# EAGLE design InkTime (EAGLE 9.7.0)

## Sheet 1 of 2
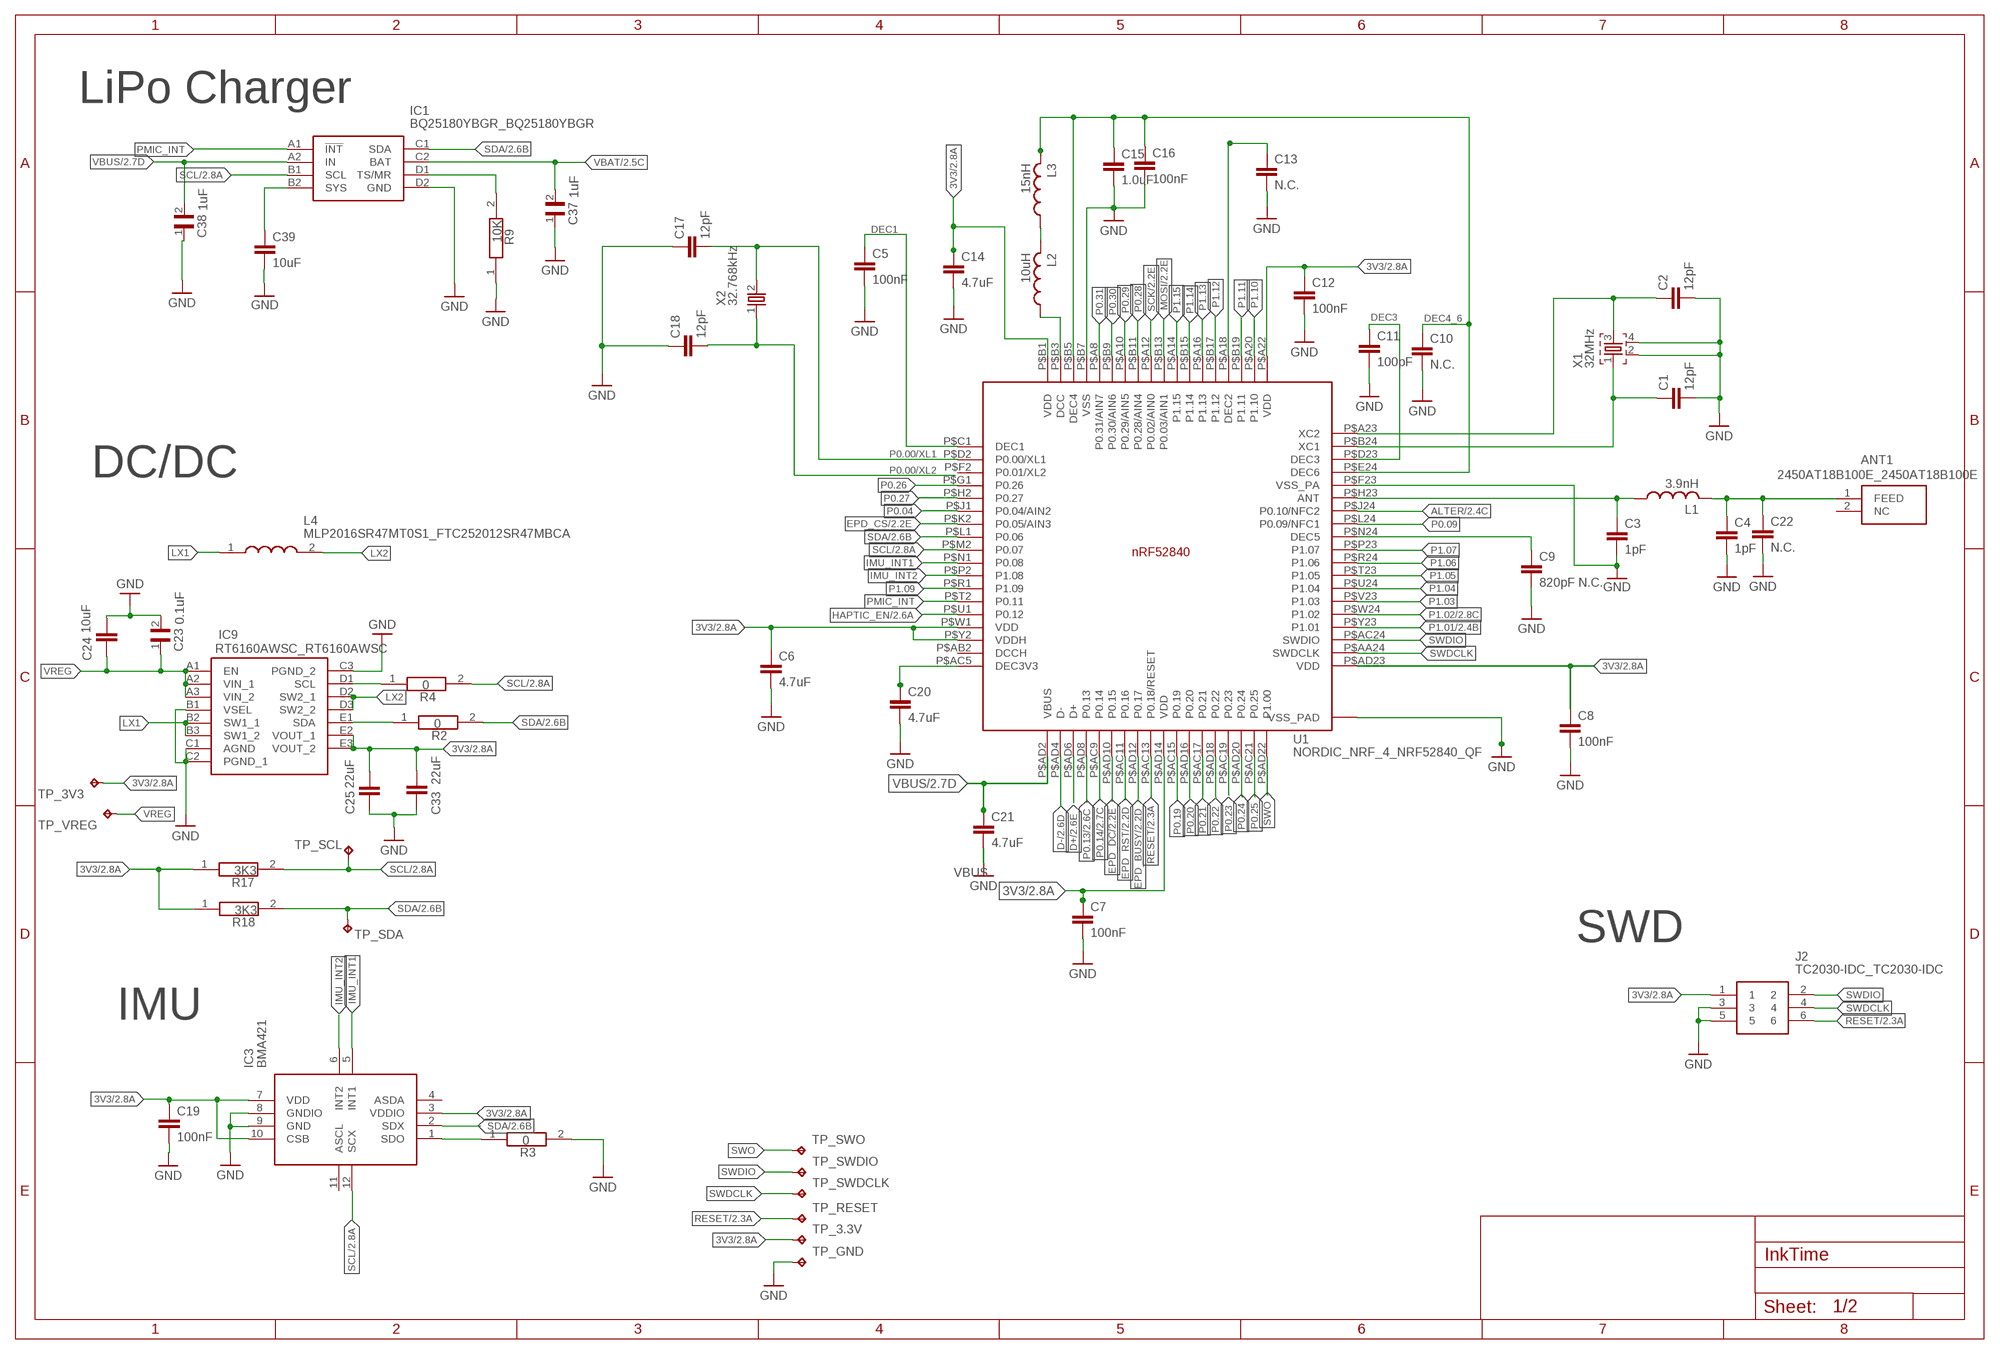
[diagram p0: schematic, sheet 1]

### Parts
ANT1  2450AT18B100E_2450AT18B100E  [2450AT18B100E_ANTC3216X140N]
C1  12pF  NORDIC_NRF_3_CAPACITOR_0201_N  [NORDIC_NRF_3_RESC0201_N]
C2  12pF  NORDIC_NRF_3_CAPACITOR_0201_N  [NORDIC_NRF_3_RESC0201_N]
C3  1pF  NORDIC_NRF_3_CAPACITOR_0201_N  [NORDIC_NRF_3_RESC0201_N]
C4  1pF  NORDIC_NRF_3_CAPACITOR_0201_N  [NORDIC_NRF_3_RESC0201_N]
C5  100nF  NORDIC_NRF_3_CAPACITOR_0201_N  [NORDIC_NRF_3_RESC0201_N]
C6  4.7uF  NORDIC_NRF_3_CAPACITORCAPACITOR_4020  [NORDIC_NRF_3_RESC0402_N]
C7  100nF  NORDIC_NRF_3_CAPACITOR_0201_N  [NORDIC_NRF_3_RESC0201_N]
C8  100nF  NORDIC_NRF_3_CAPACITOR_0201_N  [NORDIC_NRF_3_RESC0201_N]
C9  820pF N.C.  NORDIC_NRF_3_CAPACITOR_0201_N  [NORDIC_NRF_3_RESC0201_N]
C10  N.C.  NORDIC_NRF_3_CAPACITORCAPACITOR_4020  [NORDIC_NRF_3_RESC0402_N]
C11  100pF  NORDIC_NRF_3_CAPACITOR_0201_N  [NORDIC_NRF_3_RESC0201_N]
C12  100nF  NORDIC_NRF_3_CAPACITOR_0201_N  [NORDIC_NRF_3_RESC0201_N]
C13  N.C.  NORDIC_NRF_3_CAPACITOR_0201_N  [NORDIC_NRF_3_RESC0201_N]
C14  4.7uF  NORDIC_NRF_3_CAPACITORCAPACITOR_4020  [NORDIC_NRF_3_RESC0402_N]
C15  1.0uF  NORDIC_NRF_3_CAPACITORCAPACITOR_4020  [NORDIC_NRF_3_RESC0402_N]
C16  100nF  NORDIC_NRF_3_CAPACITOR_0201_N  [NORDIC_NRF_3_RESC0201_N]
C17  12pF  NORDIC_NRF_3_CAPACITOR_0201_N  [NORDIC_NRF_3_RESC0201_N]
C18  12pF  NORDIC_NRF_3_CAPACITOR_0201_N  [NORDIC_NRF_3_RESC0201_N]
C19  100nF  NORDIC_NRF_3_CAPACITOR_0201_N  [NORDIC_NRF_3_RESC0201_N]
C20  4.7uF  NORDIC_NRF_3_CAPACITORCAPACITOR_4020  [NORDIC_NRF_3_RESC0402_N]
C21  4.7uF  NORDIC_NRF_3_CAPACITORCAPACITOR_4020  [NORDIC_NRF_3_RESC0402_N]
C22  N.C.  NORDIC_NRF_3_CAPACITOR_0201_N  [NORDIC_NRF_3_RESC0201_N]
C23  0.1uF  GRM011R60J152KE01L_2_GRM011R60J152KE01LGRM011R60J152KE01L  [GRM011R60J152KE01L_2_CAPC0201X13N]
C24  10uF  NORDIC_NRF_3_CAPACITORCAPACITOR_4020  [NORDIC_NRF_3_RESC0402_N]
C25  22uF  NORDIC_NRF_3_CAPACITORCAPACITOR_4020  [NORDIC_NRF_3_RESC0402_N]
C33  22uF  NORDIC_NRF_3_CAPACITORCAPACITOR_4020  [NORDIC_NRF_3_RESC0402_N]
C37  1uF  GRM011R60J152KE01L_2_GRM011R60J152KE01LGRM011R60J152KE01L  [GRM011R60J152KE01L_2_CAPC0201X13N]
C38  1uF  GRM011R60J152KE01L_2_GRM011R60J152KE01LGRM011R60J152KE01L  [GRM011R60J152KE01L_2_CAPC0201X13N]
C39  10uF  NORDIC_NRF_3_CAPACITORCAPACITOR_4020  [NORDIC_NRF_3_RESC0402_N]
IC1  BQ25180YBGR_BQ25180YBGR  [BQ25180YBGR_BGA8C40P2X4_100X155X50]
IC3  BMA421  BMA423_BMA423  [BMA423_BMA423]
IC9  RT6160AWSC_RT6160AWSC  [RT6160AWSC_BGA15C40P3X5_140X230X60]
J2  TC2030-IDC_TC2030-IDC  [TC2030-IDC_TC2030IDC]
L1  3.9nH  NORDIC_NRF_2_INDUCTOR_0201_N  [NORDIC_NRF_2_RESC0201_N]
L2  10uH  NORDIC_NRF_2_INDUCTOR_0402_N  [NORDIC_NRF_2_RESC0402_N]
L3  15nH  NORDIC_NRF_2_INDUCTOR_0201_N  [NORDIC_NRF_2_RESC0201_N]
L4  MLP2016SR47MT0S1_FTC252012SR47MBCA  [MLP2016SR47MT0S1_INDC2016X100N]
R2  0  CPF0201D7K68C1_CPF0201D7K68C1  [CPF0201D7K68C1_0201]
R3  0  CPF0201D7K68C1_CPF0201D7K68C1  [CPF0201D7K68C1_0201]
R4  0  CPF0201D7K68C1_CPF0201D7K68C1  [CPF0201D7K68C1_0201]
R9  10K  CPF0201D7K68C1_CPF0201D7K68C1  [CPF0201D7K68C1_0201]
R17  3K3  CPF0201D7K68C1_CPF0201D7K68C1  [CPF0201D7K68C1_0201]
R18  3K3  CPF0201D7K68C1_CPF0201D7K68C1  [CPF0201D7K68C1_0201]
TP_3.3V  HECTOR_WATCH_1_TPTP20R  [HECTOR_WATCH_1_TP20R]
TP_3V3  HECTOR_WATCH_1_TPTP20R  [HECTOR_WATCH_1_TP20R]
TP_GND  HECTOR_WATCH_1_TPTP20R  [HECTOR_WATCH_1_TP20R]
TP_RESET  HECTOR_WATCH_1_TPTP20R  [HECTOR_WATCH_1_TP20R]
TP_SCL  HECTOR_WATCH_1_TPTP20R  [HECTOR_WATCH_1_TP20R]
TP_SDA  HECTOR_WATCH_1_TPTP20R  [HECTOR_WATCH_1_TP20R]
TP_SWDCLK  HECTOR_WATCH_1_TPTP20R  [HECTOR_WATCH_1_TP20R]
TP_SWDIO  HECTOR_WATCH_1_TPTP20R  [HECTOR_WATCH_1_TP20R]
TP_SWO  HECTOR_WATCH_1_TPTP20R  [HECTOR_WATCH_1_TP20R]
TP_VREG  HECTOR_WATCH_1_TPTP20R  [HECTOR_WATCH_1_TP20R]
U1  NORDIC_NRF_4_NRF52840_QF  [NORDIC_NRF_4_AQFN50P700X700X85_HS-74N]
X1  32MHz  NORDIC_NRF_XTAL_32MHZ  [NORDIC_NRF_BT-XTAL_2016_N]
X2  32.768kHz  NORDIC_NRF_1_XTAL_32KHZ  [NORDIC_NRF_1_XTAL_3215_N]

### Nets
3V3: C6.1 C7.1 C8.1 C12.1 C14.1 C19.1 C25.1 C33.1 IC3.3(VDDIO) IC3.7(VDD) IC3.10(CSB) IC9.E2(VOUT_1) IC9.E3(VOUT_2) J2.1 R17.1 R18.1 TP_3.3V.TP TP_3V3.TP U1.P$A22(VDD) U1.P$AD14(VDD) U1.P$AD23(VDD) U1.P$B1(VDD) U1.P$W1(VDD) ; also sheet 2
ALTER: U1.P$J24(P0.10/NFC2) ; also sheet 2
D+: U1.P$AD6(D+) ; also sheet 2
D-: U1.P$AD4(D-) ; also sheet 2
DEC1: C5.1 U1.P$C1(DEC1)
DEC2: C13.1 U1.P$A18(DEC2)
DEC3: C11.1 U1.P$D23(DEC3)
DEC4_6: C10.1 C15.1 C16.1 L3.2 U1.P$B5(DEC4) U1.P$E24(DEC6)
EPD_BUSY: U1.P$AD12(P0.17) ; also sheet 2
EPD_CS: U1.P$K2(P0.05/AIN3) ; also sheet 2
EPD_DC: U1.P$AD10(P0.15) ; also sheet 2
EPD_RST: U1.P$AC11(P0.16) ; also sheet 2
GND: C1.2 C2.2 C3.2 C4.2 C5.2 C6.2 C7.2 C8.2 C9.2 C10.2 C11.2 C12.2 C13.2 C14.2 C15.2 C16.2 C17.1 C18.1 C19.2 C20.2 C21.2 C22.2 C23.2 C24.1 C25.2 C33.2 C37.1 C38.1 C39.2 IC1.D2(GND) IC3.8(GNDIO) IC3.9(GND) IC9.B1(VSEL) IC9.C1(AGND) IC9.C2(PGND_1) IC9.C3(PGND_2) J2.3 J2.5 R3.2 R9.1 TP_GND.TP U1.P$74(VSS_PAD) U1.P$75(VSS_PAD) U1.P$76(VSS_PAD) U1.P$77(VSS_PAD) U1.P$78(VSS_PAD) U1.P$79(VSS_PAD) U1.P$80(VSS_PAD) U1.P$81(VSS_PAD) U1.P$82(VSS_PAD) U1.P$83(VSS_PAD) U1.P$84(VSS_PAD) U1.P$85(VSS_PAD) U1.P$86(VSS_PAD) U1.P$87(VSS_PAD) U1.P$88(VSS_PAD) U1.P$89(VSS_PAD) U1.P$90(VSS_PAD) U1.P$B7(VSS) U1.P$F23(VSS_PA) X1.2 X1.4 ; also sheet 2
HAPTIC_EN: U1.P$U1(P0.12) ; also sheet 2
IMU_INT1: IC3.5(INT1) U1.P$N1(P0.08)
IMU_INT2: IC3.6(INT2) U1.P$P2(P1.08)
LX1: IC9.B2(SW1_1) IC9.B3(SW1_2) L4.1
LX2: IC9.D2(SW2_1) IC9.D3(SW2_2) L4.2
MOSI: U1.P$B13(P0.03/AIN1) ; also sheet 2
N$1: L2.2 L3.1
N$2: C20.1 U1.P$AC5(DEC3V3)
N$3: U1.P$Y2(VDDH)
N$4: L2.1 U1.P$B3(DCC)
N$5: C3.1 L1.1 U1.P$H23(ANT)
N$6: C9.1 U1.P$N24(DEC5)
N$7: C2.1 U1.P$A23(XC2) X1.3
N$8: ANT1.1(FEED) C4.1 C22.1 L1.2
N$9: C1.1 U1.P$B24(XC1) X1.1
N$10: IC9.D1(SCL) R4.1
N$11: IC9.E1(SDA) R2.1
N$12: C39.1 IC1.B2(SYS)
N$13: IC1.D1(TS/MR) R9.2
N$14: IC3.1(SDO) R3.1
P0.00/XL1: C17.2 U1.P$D2(P0.00/XL1) X2.2
P0.00/XL2: C18.2 X2.1
P0.04: U1.P$J1(P0.04/AIN2)
P0.09: U1.P$L24(P0.09/NFC1)
P0.13: U1.P$AD8(P0.13) ; also sheet 2
P0.14: U1.P$AC9(P0.14) ; also sheet 2
P0.19: U1.P$AC15(P0.19)
P0.20: U1.P$AD16(P0.20)
P0.21: U1.P$AC17(P0.21)
P0.22: U1.P$AD18(P0.22)
P0.23: U1.P$AC19(P0.23)
P0.24: U1.P$AD20(P0.24)
P0.25: U1.P$AC21(P0.25)
P0.26: U1.P$G1(P0.26)
P0.27: U1.P$H2(P0.27)
P0.28: U1.P$B11(P0.28/AIN4)
P0.29: U1.P$A10(P0.29/AIN5)
P0.30: U1.P$B9(P0.30/AIN6)
P0.31: U1.P$A8(P0.31/AIN7)
P1.01: U1.P$Y23(P1.01) ; also sheet 2
P1.02: U1.P$W24(P1.02) ; also sheet 2
P1.03: U1.P$V23(P1.03)
P1.04: U1.P$U24(P1.04)
P1.05: U1.P$T23(P1.05)
P1.06: U1.P$R24(P1.06)
P1.07: U1.P$P23(P1.07)
P1.09: U1.P$R1(P1.09)
P1.10: U1.P$A20(P1.10)
P1.11: U1.P$B19(P1.11)
P1.12: U1.P$B17(P1.12)
P1.13: U1.P$A16(P1.13)
P1.14: U1.P$B15(P1.14)
P1.15: U1.P$A14(P1.15)
PMIC_INT: IC1.A1(!INT) U1.P$T2(P0.11)
RESET: J2.6 TP_RESET.TP U1.P$AC13(P0.18/RESET) ; also sheet 2
SCK: U1.P$A12(P0.02/AIN0) ; also sheet 2
SCL: IC1.B1(SCL) IC3.12(SCX) R4.2 R17.2 TP_SCL.TP U1.P$M2(P0.07) ; also sheet 2
SDA: IC1.C1(SDA) IC3.2(SDX) R2.2 R18.2 TP_SDA.TP U1.P$L1(P0.06) ; also sheet 2
SWDCLK: J2.4 TP_SWDCLK.TP U1.P$AA24(SWDCLK)
SWDIO: J2.2 TP_SWDIO.TP U1.P$AC24(SWDIO)
SWO: TP_SWO.TP U1.P$AD22(P1.00)
VBAT: C37.2 IC1.C2(BAT) ; also sheet 2
VBUS: C21.1 C38.2 IC1.A2(IN) U1.P$AD2(VBUS) ; also sheet 2
VREG: C23.1 C24.2 IC9.A1(EN) IC9.A2(VIN_1) IC9.A3(VIN_2) TP_VREG.TP
Unconnected: ANT1.2(NC) IC3.4(ASDA) IC3.11(ASCL) U1.P$AB2(DCCH) U1.P$F2(P0.01/XL2)

### Notes on the sheet
- LiPo Charger
- DC/DC
- SWD
- IMU

## Sheet 2 of 2
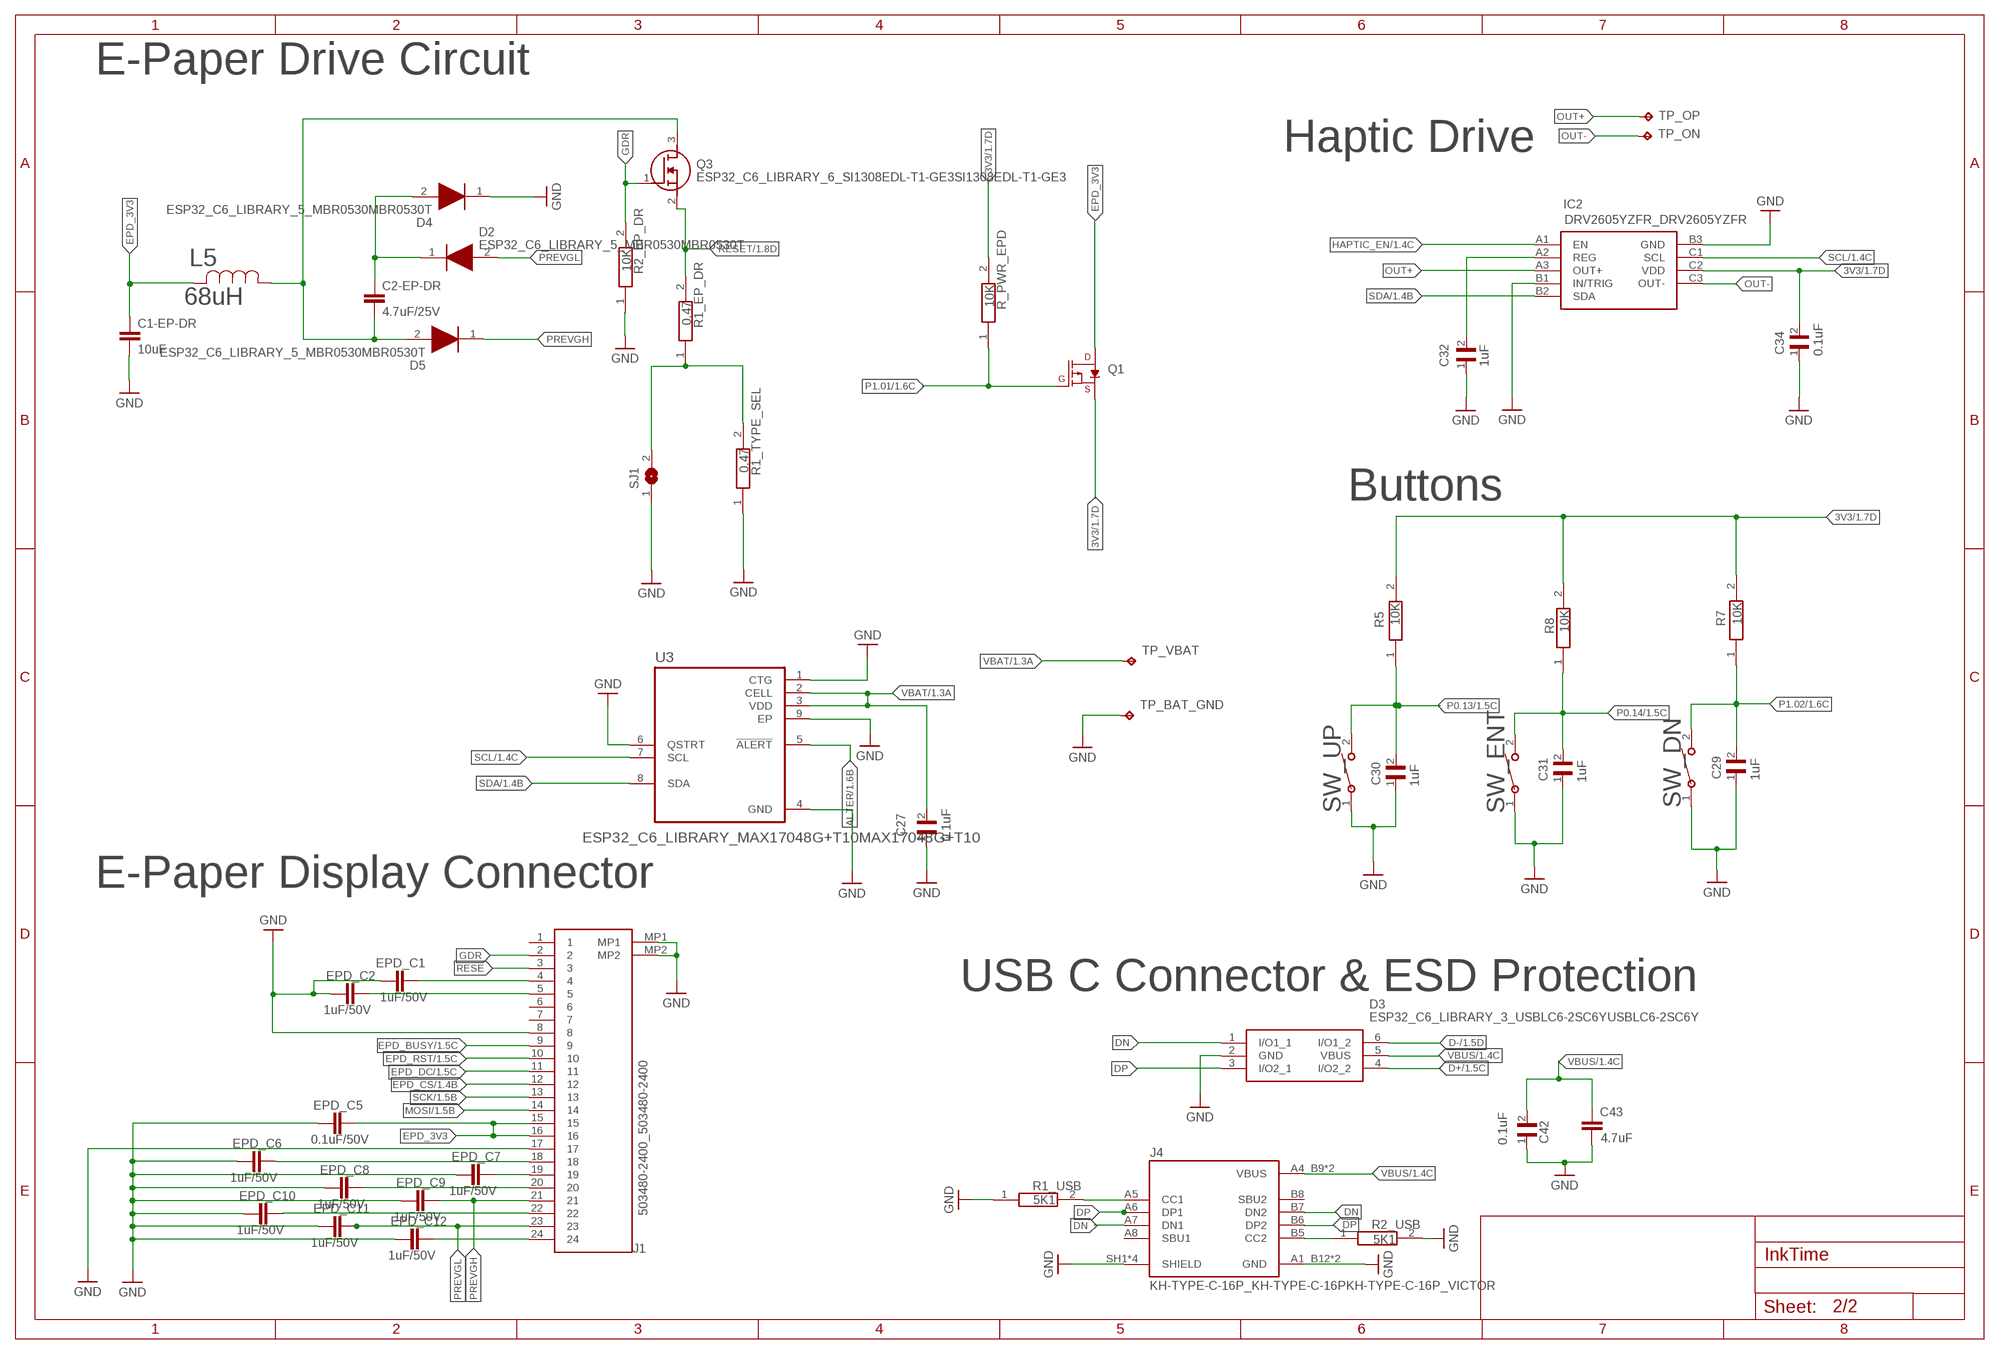
[diagram p1: schematic, sheet 2]

### Parts
C1-EP-DR  10uF  NORDIC_NRF_3_CAPACITORCAPACITOR_4020  [NORDIC_NRF_3_RESC0402_N]
C2-EP-DR  4.7uF/25V  NORDIC_NRF_3_CAPACITOR_0201_N  [NORDIC_NRF_3_RESC0201_N]
C27  0.1uF  GRM011R60J152KE01L_2_GRM011R60J152KE01LGRM011R60J152KE01L  [GRM011R60J152KE01L_2_CAPC0201X13N]
C29  1uF  GRM011R60J152KE01L_2_GRM011R60J152KE01LGRM011R60J152KE01L  [GRM011R60J152KE01L_2_CAPC0201X13N]
C30  1uF  GRM011R60J152KE01L_2_GRM011R60J152KE01LGRM011R60J152KE01L  [GRM011R60J152KE01L_2_CAPC0201X13N]
C31  1uF  GRM011R60J152KE01L_2_GRM011R60J152KE01LGRM011R60J152KE01L  [GRM011R60J152KE01L_2_CAPC0201X13N]
C32  1uF  GRM011R60J152KE01L_2_GRM011R60J152KE01LGRM011R60J152KE01L  [GRM011R60J152KE01L_2_CAPC0201X13N]
C34  0.1uF  GRM011R60J152KE01L_2_GRM011R60J152KE01LGRM011R60J152KE01L  [GRM011R60J152KE01L_2_CAPC0201X13N]
C42  0.1uF  GRM011R60J152KE01L_2_GRM011R60J152KE01LGRM011R60J152KE01L  [GRM011R60J152KE01L_2_CAPC0201X13N]
C43  4.7uF  NORDIC_NRF_3_CAPACITORCAPACITOR_4020  [NORDIC_NRF_3_RESC0402_N]
D2  ESP32_C6_LIBRARY_5_MBR0530MBR0530T  [ESP32_C6_LIBRARY_5_SOD3716X135N]
D3  ESP32_C6_LIBRARY_3_USBLC6-2SC6YUSBLC6-2SC6Y  [ESP32_C6_LIBRARY_3_SOT95P280X145-6N]
D4  ESP32_C6_LIBRARY_5_MBR0530MBR0530T  [ESP32_C6_LIBRARY_5_SOD3716X135N]
D5  ESP32_C6_LIBRARY_5_MBR0530MBR0530T  [ESP32_C6_LIBRARY_5_SOD3716X135N]
EPD_C1  1uF/50V  NORDIC_NRF_3_CAPACITORCAPACITOR_4020  [NORDIC_NRF_3_RESC0402_N]
EPD_C2  1uF/50V  NORDIC_NRF_3_CAPACITORCAPACITOR_4020  [NORDIC_NRF_3_RESC0402_N]
EPD_C5  0.1uF/50V  NORDIC_NRF_3_CAPACITORCAPACITOR_4020  [NORDIC_NRF_3_RESC0402_N]
EPD_C6  1uF/50V  NORDIC_NRF_3_CAPACITORCAPACITOR_4020  [NORDIC_NRF_3_RESC0402_N]
EPD_C7  1uF/50V  NORDIC_NRF_3_CAPACITORCAPACITOR_4020  [NORDIC_NRF_3_RESC0402_N]
EPD_C8  1uF/50V  NORDIC_NRF_3_CAPACITORCAPACITOR_4020  [NORDIC_NRF_3_RESC0402_N]
EPD_C9  1uF/50V  NORDIC_NRF_3_CAPACITORCAPACITOR_4020  [NORDIC_NRF_3_RESC0402_N]
EPD_C10  1uF/50V  NORDIC_NRF_3_CAPACITORCAPACITOR_4020  [NORDIC_NRF_3_RESC0402_N]
EPD_C11  1uF/50V  NORDIC_NRF_3_CAPACITORCAPACITOR_4020  [NORDIC_NRF_3_RESC0402_N]
EPD_C12  1uF/50V  NORDIC_NRF_3_CAPACITORCAPACITOR_4020  [NORDIC_NRF_3_RESC0402_N]
IC2  DRV2605YZFR_DRV2605YZFR  [DRV2605YZFR_BGA9C50P3X3_144X144X62]
J1  503480-2400_503480-2400  [503480-2400_5034802400]
J4  KH-TYPE-C-16P_KH-TYPE-C-16PKH-TYPE-C-16P_VICTOR  [KH-TYPE-C-16P_KINGHELM_KH-TYPE-C-16P]
L5  68uH  ESP32_C6_LIBRARY_2_744043680IND_4828-WE-TPC_WRE  [ESP32_C6_LIBRARY_2_IND_4828-WE-TPC_WRE]
Q1  ESP32_C6_LIBRARY_4_ESP32_WROVER_SPARKFUN-DISCRETESEMI_MOSFET_PCH  [ESP32_C6_LIBRARY_4_ESP32_C6_LIBRARY_4_ESP32_C6_LIBRARY_4_ESP32_C6_LIBRARY_4_ESP32_WROVER_SPARKFUN-DISCRETESEMI_SOT23-3]
Q3  ESP32_C6_LIBRARY_6_SI1308EDL-T1-GE3SI1308EDL-T1-GE3  [ESP32_C6_LIBRARY_6_SOT65P210X110-3N]
R1_EP_DR  0.47  CPF0201D7K68C1_CPF0201D7K68C1  [CPF0201D7K68C1_0201]
R1_TYPE_SEL  0.47  CPF0201D7K68C1_CPF0201D7K68C1  [CPF0201D7K68C1_0201]
R1_USB  5K1  CPF0201D7K68C1_CPF0201D7K68C1  [CPF0201D7K68C1_0201]
R2_EP_DR  10K  CPF0201D7K68C1_CPF0201D7K68C1  [CPF0201D7K68C1_0201]
R2_USB  5K1  CPF0201D7K68C1_CPF0201D7K68C1  [CPF0201D7K68C1_0201]
R5  10K  CPF0201D7K68C1_CPF0201D7K68C1  [CPF0201D7K68C1_0201]
R7  10K  CPF0201D7K68C1_CPF0201D7K68C1  [CPF0201D7K68C1_0201]
R8  10K  CPF0201D7K68C1_CPF0201D7K68C1  [CPF0201D7K68C1_0201]
R_PWR_EPD  10K  CPF0201D7K68C1_CPF0201D7K68C1  [CPF0201D7K68C1_0201]
SJ1  ESP32_C6_LIBRARY_7_JUMPER_SJ  [ESP32_C6_LIBRARY_7_JUMPER_SJ]
SW_DN  2025-10-22_07-23-44_LIBRARY_EVP-AKE31A  [2025-10-22_07-23-44_LIBRARY_SW_EVP-AKE31A_PAN]
SW_ENT  2025-10-22_07-23-44_LIBRARY_EVP-AKE31A  [2025-10-22_07-23-44_LIBRARY_SW_EVP-AKE31A_PAN]
SW_UP  2025-10-22_07-23-44_LIBRARY_EVP-AKE31A  [2025-10-22_07-23-44_LIBRARY_SW_EVP-AKE31A_PAN]
TP_BAT_GND  HECTOR_WATCH_1_TPTP20R  [HECTOR_WATCH_1_TP20R]
TP_ON  HECTOR_WATCH_1_TPTP20R  [HECTOR_WATCH_1_TP20R]
TP_OP  HECTOR_WATCH_1_TPTP20R  [HECTOR_WATCH_1_TP20R]
TP_VBAT  HECTOR_WATCH_1_TPTP20R  [HECTOR_WATCH_1_TP20R]
U3  ESP32_C6_LIBRARY_MAX17048G+T10MAX17048G+T10  [ESP32_C6_LIBRARY_SON50P200X200X80-9N]

### Nets
3V3: C34.2 IC2.C2(VDD) Q1.2(S) R5.2 R7.2 R8.2 R_PWR_EPD.2 ; also sheet 1
ALTER: U3.5(!ALERT) ; also sheet 1
D+: D3.4(I/O2_2) ; also sheet 1
D-: D3.6(I/O1_2) ; also sheet 1
DN: D3.1(I/O1_1) J4.A7(DN1) J4.B7(DN2)
DP: D3.3(I/O2_1) J4.A6(DP1) J4.B6(DP2)
EPD_3V3: C1-EP-DR.1 EPD_C5.1 J1.15 J1.16 L5.2 Q1.3(D)
EPD_BUSY: J1.9 ; also sheet 1
EPD_CS: J1.12 ; also sheet 1
EPD_DC: J1.11 ; also sheet 1
EPD_RST: J1.10 ; also sheet 1
GDR: J1.2 Q3.1(G) R2_EP_DR.2
GND: C1-EP-DR.2 C27.1 C29.1 C30.1 C31.1 C32.1 C34.1 C42.1 C43.1 D3.2(GND) D4.1(K) EPD_C1.2 EPD_C2.2 EPD_C5.2 EPD_C6.2 EPD_C7.2 EPD_C8.2 EPD_C9.2 EPD_C10.2 EPD_C11.2 EPD_C12.2 IC2.B1(IN/TRIG) IC2.B3(GND) J1.8 J1.17 J1.MP1 J1.MP2 J4.A1_B12(GND) J4.A12_B1(GND) J4.SH1(SHIELD) J4.SH2(SHIELD) J4.SH3(SHIELD) J4.SH4(SHIELD) R1_TYPE_SEL.1 R1_USB.1 R2_EP_DR.1 R2_USB.2 SJ1.1 SW_DN.1 SW_ENT.1 SW_UP.1 TP_BAT_GND.TP U3.1(CTG) U3.4(GND) U3.6(QSTRT) U3.9(EP) ; also sheet 1
HAPTIC_EN: IC2.A1(EN) ; also sheet 1
MOSI: J1.14 ; also sheet 1
N$16: C2-EP-DR.2 D5.2(A) L5.1 Q3.3(D)
N$17: C2-EP-DR.1 D2.1(K) D4.2(A)
N$18: J4.B5(CC2) R2_USB.1
N$20: R1_EP_DR.1 R1_TYPE_SEL.2 SJ1.2
N$21: J4.A5(CC1) R1_USB.2
N$23: C32.2 IC2.A2(REG)
N$25: EPD_C1.1 J1.4
N$26: EPD_C2.1 J1.5
N$28: EPD_C6.1 J1.18
N$29: EPD_C7.1 J1.19
N$30: EPD_C8.1 J1.20
N$32: EPD_C10.1 J1.22
N$34: EPD_C12.1 J1.24
OUT+: IC2.A3(OUT+) TP_OP.TP
OUT-: IC2.C3(OUT-) TP_ON.TP
P0.13: C30.2 R5.1 SW_UP.2 ; also sheet 1
P0.14: C31.2 R8.1 SW_ENT.2 ; also sheet 1
P1.01: Q1.1(G) R_PWR_EPD.1 ; also sheet 1
P1.02: C29.2 R7.1 SW_DN.2 ; also sheet 1
PREVGH: D5.1(K) EPD_C9.1 J1.21
PREVGL: D2.2(A) EPD_C11.1 J1.23
RESE: J1.3
RESET: Q3.2(S) R1_EP_DR.2 ; also sheet 1
SCK: J1.13 ; also sheet 1
SCL: IC2.C1(SCL) U3.7(SCL) ; also sheet 1
SDA: IC2.B2(SDA) U3.8(SDA) ; also sheet 1
VBAT: C27.2 TP_VBAT.TP U3.2(CELL) U3.3(VDD) ; also sheet 1
VBUS: C42.2 C43.2 D3.5(VBUS) J4.A4_B9(VBUS) J4.A9_B4(VBUS) ; also sheet 1
Unconnected: J1.1 J1.6 J1.7 J4.A8(SBU1) J4.B8(SBU2)

### Notes on the sheet
- E-Paper Drive Circuit
- Haptic Drive
- Buttons
- E-Paper Display Connector
- USB C Connector & ESD Protection

## Library data of the parts
ANT1 = InkTime_v5:2450AT18B100E_2450AT18B100E: Antennas 2.45GHz ANTENNA Source: Datasheet <https://www.johansontechnology.com/datasheets/2450AT18B100/2450AT18B100.pdf>; ARROW_PART_NUMBER: 2450AT18B100E; ARROW_PRICE-STOCK: https://www.arrow.com/en/products/2450at18b100e/johanson-dielectrics?utm_currency=USD&region=nac; DESCRIPTION: Antennas 2.45GHz ANTENNA; HEIGHT: 1.4mm; MANUFACTURER_NAME: JOHANSON TECHNOLOGY; MANUFACTURER_PART_NUMBER: 2450AT18B100E; MOUSER_PART_NUMBER: 609-2450AT18B100E; MOUSER_PRICE-STOCK: https://www.mouser.co.uk/ProductDetail/Johanson-Technology/2450AT18B100E?qs=yCnrNFeXz%252Bh5MFsFIXGZGA%3D%3D
C1 C1-EP-DR C2 C2-EP-DR C3-C22 C24 C25 C33 C39 C43 EPD_C1 EPD_C2 EPD_C5-EPD_C12 = InkTime_v5:NORDIC_NRF_3_CAPACITOR: Generic chip capacitor
C23 C27 C29-C32 C34 C37 C38 C42 = InkTime_v5:GRM011R60J152KE01L_2_GRM011R60J152KE01L: Check availability <https://pricing.snapeda.com/parts/GRM011R60J152KE01L/Murata/view-part?ref=eda>
D2 D4 D5 = InkTime_v5:ESP32_C6_LIBRARY_5_MBR0530: ON SEMICONDUCTOR - MBR0530 - DIODE, SCHOTTKY, 0.5A, 30V, SOD-123 Source: Datasheet <http://www.onsemi.com/pub/Collateral/MBR0530T1-D.PDF> Check availability <https://pricing.snapeda.com/parts/MBR0530/ON%20Semiconductor/view-part?ref=eda>
D3 = InkTime_v5:ESP32_C6_LIBRARY_3_USBLC6-2SC6Y: Low Cap. ESD Protection Auto SOT-23-6 STMicroelectronics USBLC6-2SC6Y, Dual Uni-Directional TVS Diode Array, 6-Pin SOT-23 Source: Datasheet <https://componentsearchengine.com/Datasheets/1/USBLC6-2SC6Y.pdf> Check availability <https://pricing.snapeda.com/parts/USBLC6-2SC6Y/STMicroelectronics/view-part?ref=eda>
IC1 = InkTime_v5:BQ25180YBGR_BQ25180YBGR: Charger IC Lithium Ion/Polymer, Lithium Iron Phosphate 8-DSBGA (1.6x1.1) Source: Datasheet <https://www.ti.com/lit/ds/symlink/bq25180.pdf?ts=1650264094470&ref_url=https%3A%2F%2Fwww.ti.com%2Fproduct%2FBQ25180>; ARROW_PART_NUMBER: BQ25180YBGR; ARROW_PRICE-STOCK: https://www.arrow.com/en/products/bq25180ybgr/texas-instruments?utm_currency=USD&region=nac; DESCRIPTION: Charger IC Lithium Ion/Polymer, Lithium Iron Phosphate 8-DSBGA (1.6x1.1); HEIGHT: 0.5mm; MANUFACTURER_NAME: Texas Instruments; MANUFACTURER_PART_NUMBER: BQ25180YBGR; MOUSER_PART_NUMBER: 595-BQ25180YBGR; MOUSER_PRICE-STOCK: https://www.mouser.co.uk/ProductDetail/Texas-Instruments/BQ25180YBGR?qs=doiCPypUmgEWjAK%252BJAX6Tw%3D%3D
IC2 = InkTime_v5:DRV2605YZFR_DRV2605YZFR: Haptic Driver for ERM/LRA with Built-In Library and Smart Loop Architecture Source: Datasheet <http://www.ti.com/lit/gpn/drv2605>; ARROW_PART_NUMBER: DRV2605YZFR; ARROW_PRICE-STOCK: https://www.arrow.com/en/products/drv2605yzfr/texas-instruments?region=nac; DESCRIPTION: Haptic Driver for ERM/LRA with Built-In Library and Smart Loop Architecture; HEIGHT: 0.625mm; MANUFACTURER_NAME: Texas Instruments; MANUFACTURER_PART_NUMBER: DRV2605YZFR
IC3 = InkTime_v5:BMA423_BMA423: Accelerometers Triaxial low-g 12bit Acceleration Sensor Source: Datasheet <https://www.mouser.com/datasheet/2/783/BST-BMA423-DS000-1509600.pdf>; ARROW_PART_NUMBER: BMA423; ARROW_PRICE-STOCK: https://www.arrow.com/en/products/bma423/bosch; DESCRIPTION: Accelerometers Triaxial low-g 12bit Acceleration Sensor; HEIGHT: 1mm; MANUFACTURER_NAME: BOSCH; MANUFACTURER_PART_NUMBER: BMA423; MOUSER_PART_NUMBER: 262-BMA423; MOUSER_PRICE-STOCK: https://www.mouser.co.uk/ProductDetail/Bosch-Sensortec/BMA423?qs=HXFqYaX1Q2xC%252BSgeGoX3mg%3D%3D
IC9 = InkTime_v5:RT6160AWSC_RT6160AWSC: Buck-Boost Regulator Positive Output Step-Up/Step-Down I2C DC-DC Controller IC 15-WL-CSP (BSC) (1.4x2.3) Source: Datasheet <https://www.richtek.com/SaveDownload.aspx?specid=RT6160A>; DESCRIPTION: Buck-Boost Regulator Positive Output Step-Up/Step-Down I2C DC-DC Controller IC 15-WL-CSP (BSC) (1.4x2.3); HEIGHT: 0.6mm; MANUFACTURER_NAME: RICHTEK; MANUFACTURER_PART_NUMBER: RT6160AWSC; MOUSER_PART_NUMBER: 835-RT6160AWSC; MOUSER_PRICE-STOCK: https://www.mouser.co.uk/ProductDetail/Richtek/RT6160AWSC?qs=amGC7iS6iy%2FLd9PSoixZXQ%3D%3D
J1 = InkTime_v5:503480-2400_503480-2400: FFC & FPC Connectors 0.5mm FPC RA SMT Dual Contact 24Ckt Source: Datasheet <https://componentsearchengine.com/Datasheets/1/503480-2400.pdf>; DESCRIPTION: FFC & FPC Connectors 0.5mm FPC RA SMT Dual Contact 24Ckt; HEIGHT: 1.87mm; MANUFACTURER_NAME: Molex; MANUFACTURER_PART_NUMBER: 503480-2400; MOUSER_PART_NUMBER: 538-503480-2400; MOUSER_PRICE-STOCK: https://www.mouser.co.uk/ProductDetail/Molex/503480-2400?qs=OAhjpuo3Vu7efIoxFh9AOw%3D%3D
J2 = InkTime_v5:TC2030-IDC_TC2030-IDC: CABLE ADAPTER 6 POS Source: Datasheet <https://datasheet.datasheetarchive.com/originals/distributors/Datasheets_SAMA/62bc384e093448baaaa63dbd0b9d8707.pdf>; DESCRIPTION: CABLE ADAPTER 6 POS; HEIGHT: 19mm; MANUFACTURER_NAME: Tag Connect; MANUFACTURER_PART_NUMBER: TC2030-IDC
J4 = InkTime_v5:KH-TYPE-C-16P_KH-TYPE-C-16P: Check availability <https://pricing.snapeda.com/parts/KH-TYPE-C-16P/kinghelm/view-part?ref=eda>
L1-L3 = InkTime_v5:NORDIC_NRF_2_INDUCTOR: Generic chip inductor
L4 = InkTime_v5:MLP2016SR47MT0S1_FTC252012SR47MBCA: SMD / SMT Inductors (Coils), L=0.47?H, L x W x T : Source: Datasheet <https://product.tdk.com/system/files/dam/doc/product/inductor/inductor/smd/catalog/inductor_commercial_power_mlp2016_en.pdf>; DESCRIPTION: SMD / SMT Inductors (Coils), L=0.47?H, L x W x T :; HEIGHT: 1mm; JLCPCB: https://jlcpcb.com/partdetail/6763488-FTC252012SR47MBCA/C5832368; MANUFACTURER_NAME: TDK; MANUFACTURER_PART_NUMBER: FTC252012SR47MBCA
L5 = InkTime_v5:ESP32_C6_LIBRARY_2_744043680; COPYRIGHT: Copyright (C) 2024 Ultra Librarian. All rights reserved.; MANUFACTURER_PART_NUMBER: 744043680; MFR_NAME: Wurth Electronics
Q1 = InkTime_v5:ESP32_C6_LIBRARY_4_ESP32_WROVER_SPARKFUN-DISCRETESEMI_MOSFET_PCH: P-channel MOSFETs Voltage controlled devices that allow control of high current outputs. SparkFun Products: SparkFun ESP32 Thing <https://www.sparkfun.com/products/13907> SparkFun ESP8266 Thing <https://www.sparkfun.com/products/13231> SparkFun Pi Servo HAT V2 <https://www.sparkfun.com/products/15316> DMG2305UX-7 (20V/4.2A/SOT23-3)
Q3 = InkTime_v5:ESP32_C6_LIBRARY_6_SI1308EDL-T1-GE3: MOSFET N-Ch 30V 1.5A TrenchFET SC70 Vishay Si1308EDL-T1-GE3 N-channel MOSFET Transistor, 1.5 A, 30 V, 3-Pin SC-70 Source: Datasheet <https://componentsearchengine.com/Datasheets/1/SI1308EDL-T1-GE3.pdf> Check availability <https://pricing.snapeda.com/parts/SI1308EDL-T1-GE3/Vishay%20Siliconix/view-part?ref=eda>
R1_EP_DR R1_TYPE_SEL R1_USB R2 R2_EP_DR R2_USB R3-R5 R7-R9 R17 R18 R_PWR_EPD = InkTime_v5:CPF0201D7K68C1_CPF0201D7K68C1: 7.68k 0201 Thin Film Surface Mount Fixed Resistor +/-0.5% 0.031W CPF0201D7K68C1 Source: Datasheet <http://www.te.com/commerce/DocumentDelivery/DDEController?Action=showdoc&DocId=Data Sheet1773200-1ApdfEnglishENG_DS_1773200-1_A.pdf4-2176215-6>
SJ1 = InkTime_v5:ESP32_C6_LIBRARY_7_JUMPER_SJ: SMD solder JUMPER
SW_DN SW_ENT SW_UP = InkTime_v5:2025-10-22_07-23-44_LIBRARY_EVP-AKE31A
TP_3.3V TP_3V3 TP_BAT_GND TP_GND TP_ON TP_OP TP_RESET TP_SCL TP_SDA TP_SWDCLK TP_SWDIO TP_SWO TP_VBAT TP_VREG = InkTime_v5:HECTOR_WATCH_1_TP: Test pad
U1 = InkTime_v5:NORDIC_NRF_4_NRF52840_QF: nRF52840 Features Advanced Single chip 2.4 GHz multi-protocol SoC 32-bit ARM Cortex-M4F Processor 1.7v to 5.5v operation 1MB flash + 256kB RAM Bluetooth 5 support for long range and high throughput 802.15.4 radio support On-chip NFC PPI –Programmable Peripheral Interconnect Automated power management system with automatic power management of each peripheral Configurable I/O mapping for analog and digital I/O 48 x GPIO 1 x QSPI 4 x Master/Slave SPI 2 x Two-wire interface (I²C) I²S interface 2 x UART 4 x PWM USB 2.0 controller ARM TrustZone CryptoCell-310 Cryptographic and security module AES 128-bit ECB/CCM/AAR hardware accelerator Digital microphone interface (PDM) Quadrature decoder 12-bit ADC Low power comparator On-chip 50Ω balun On-air compatible with nRF52, nRF51 and nRF24 Series Applications Advanced high performance wearables Wearables for secure payments Virtual Reality/Augmented Reality systems Smart Home sensor networks Smart city sensor networks High performance HID controllers Internet of Things (IoT) sensor networks Smart door locks Smart lighting networks Connected white goods
U3 = InkTime_v5:ESP32_C6_LIBRARY_MAX17048G+T10: Check availability <https://pricing.snapeda.com/parts/MAX17048G%2BT10/Analog%20Devices/view-part?ref=eda>
X1 = InkTime_v5:NORDIC_NRF_XTAL_32MHZ
X2 = InkTime_v5:NORDIC_NRF_1_XTAL_32KHZ

## Board
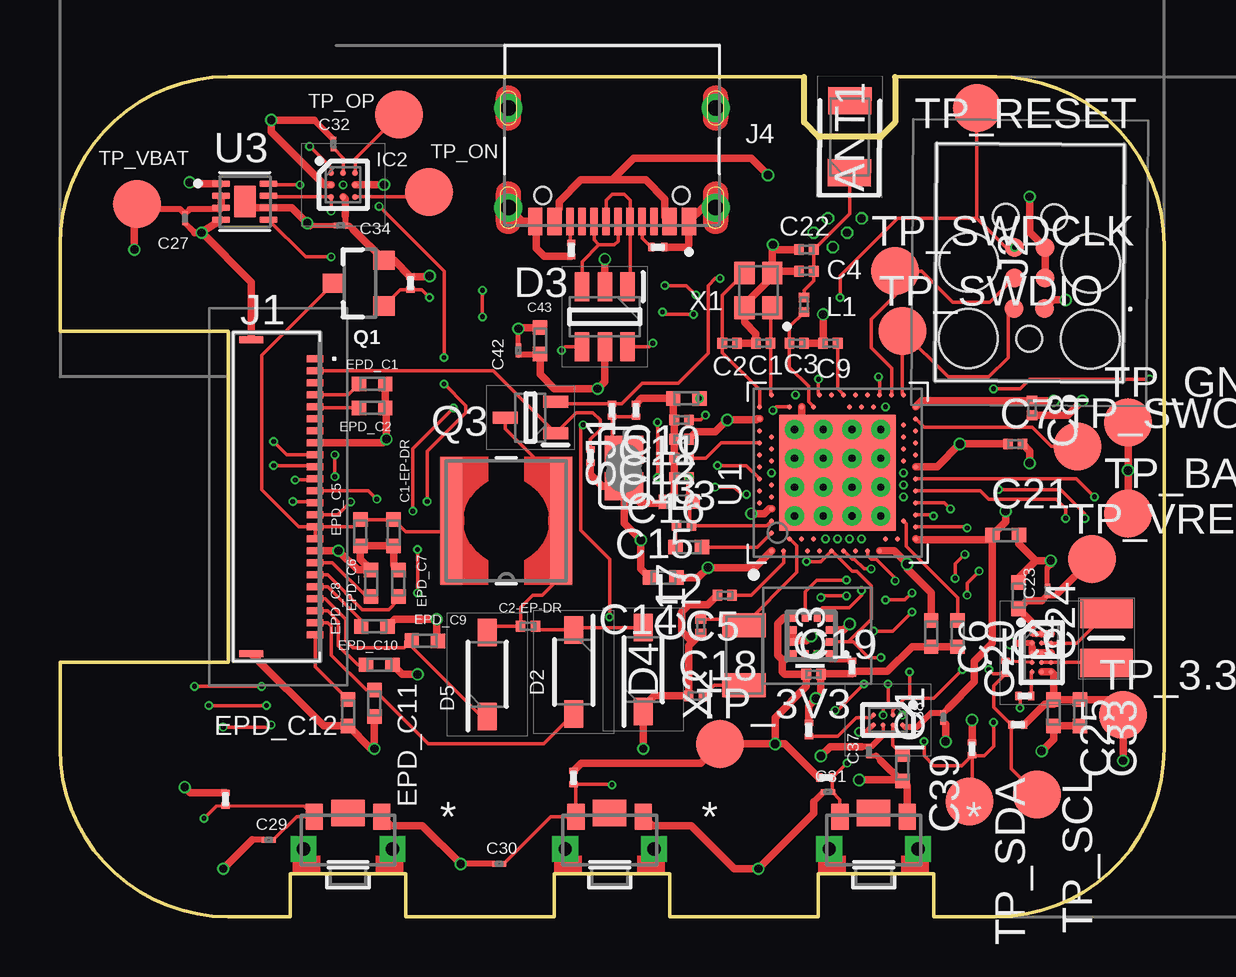
[diagram p2: board, top side]
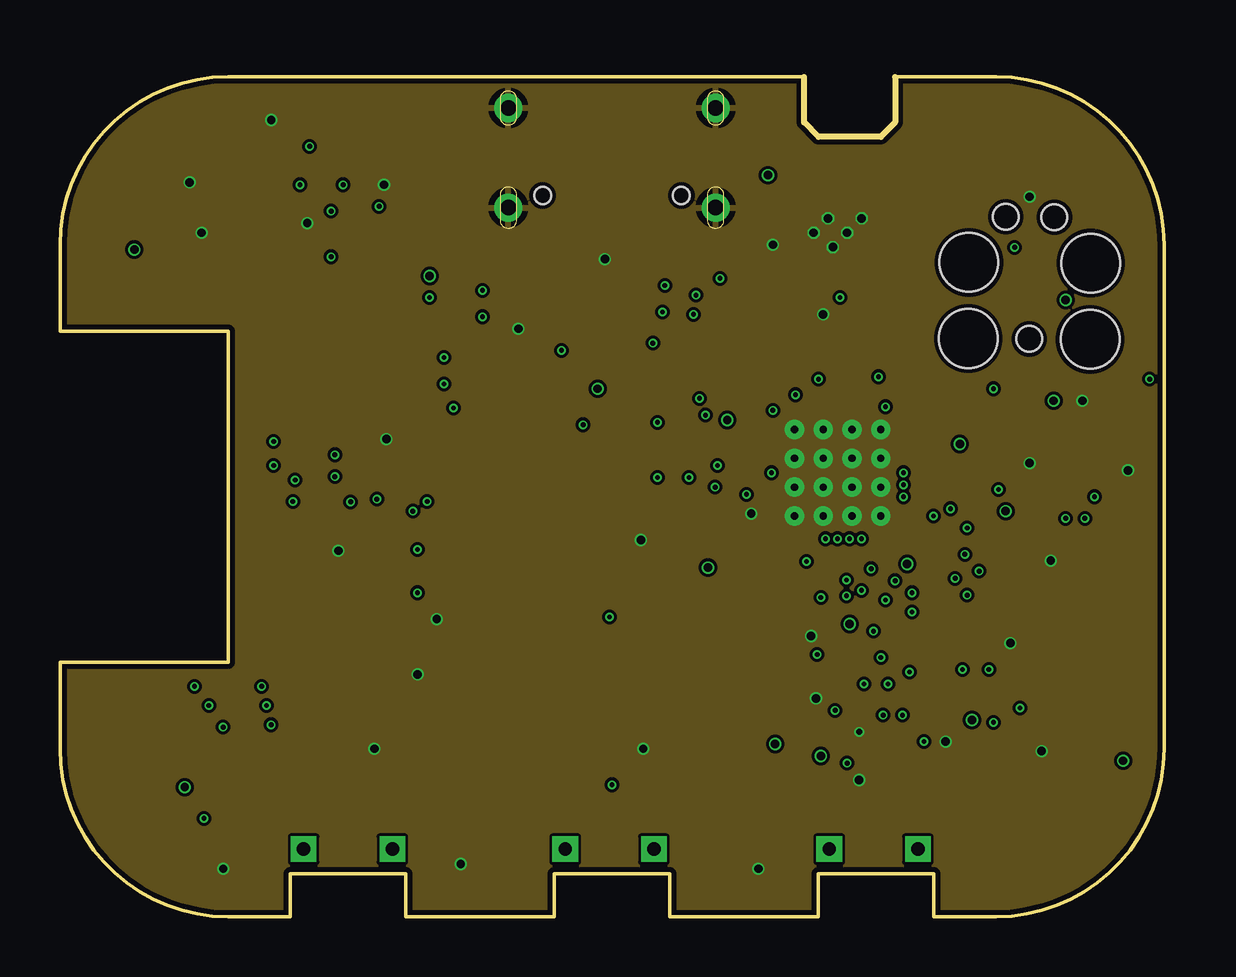
[diagram p3: board, inner layer Route2]
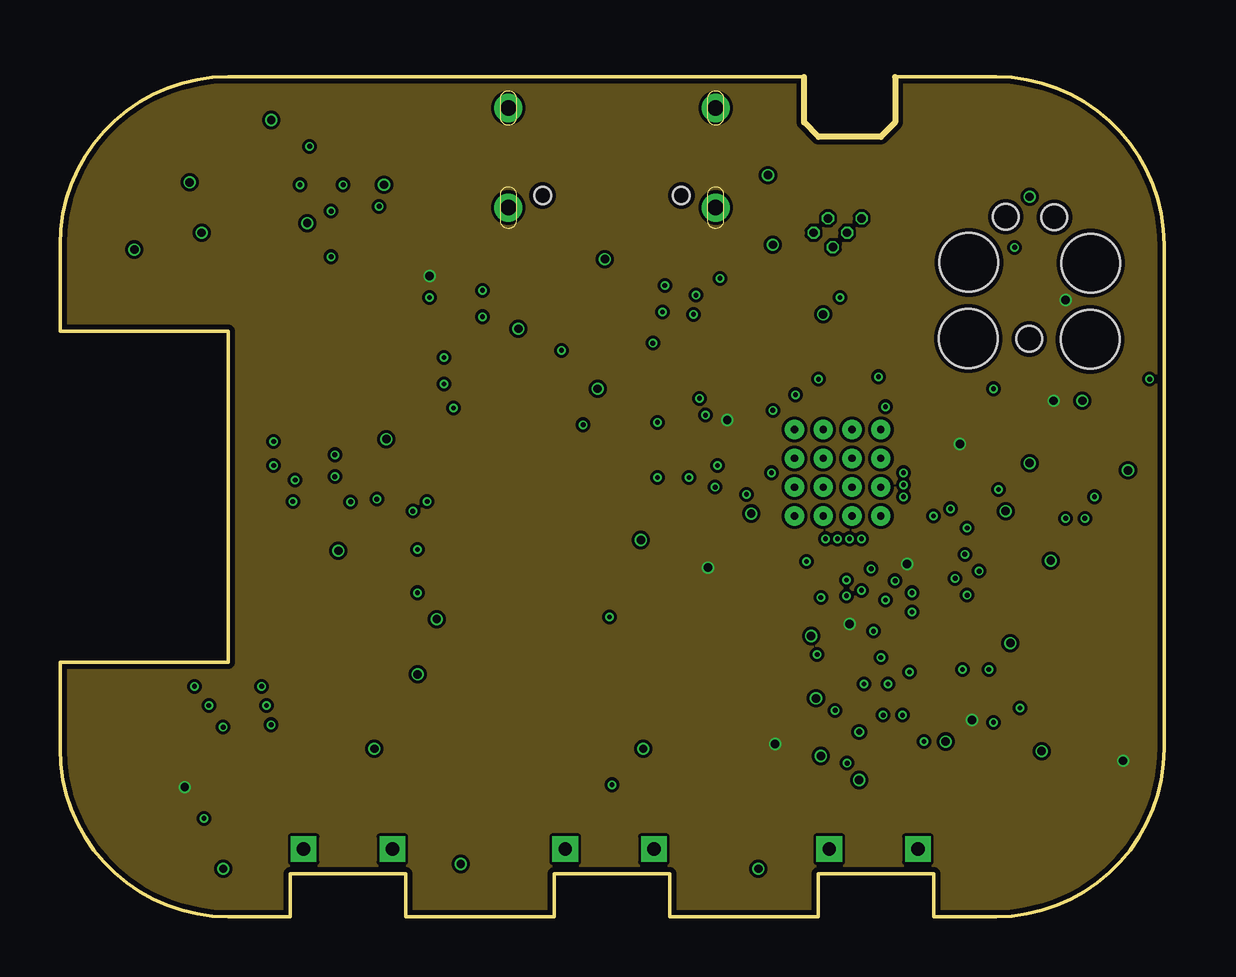
[diagram p4: board, inner layer Route15]
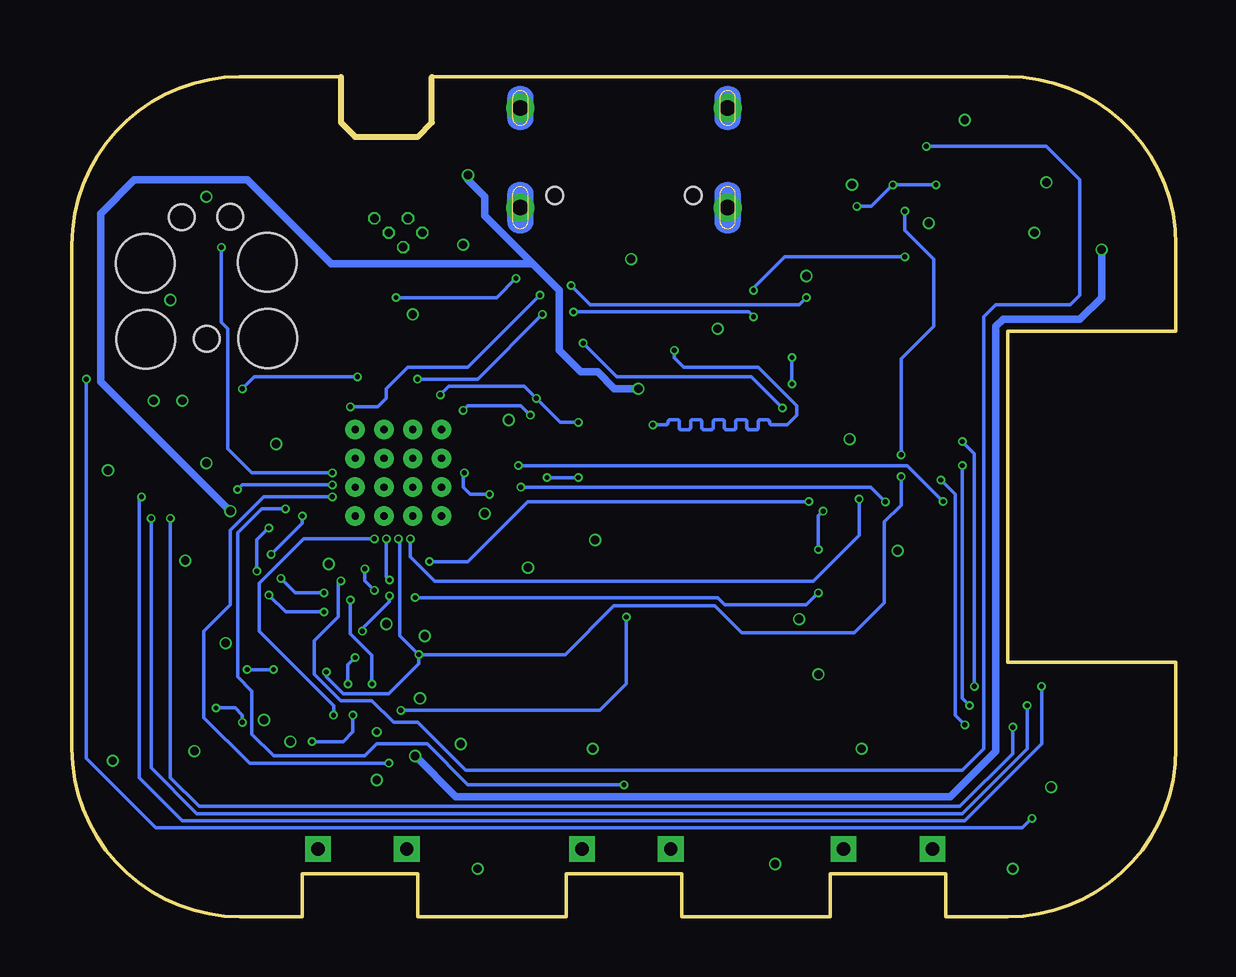
[diagram p5: board, bottom side, seen from below]

Size 46 x 35 mm. Coordinates in mm from the lower left corner, seen from the top.
Outline: 39,0 36.4,0 36.4,1.8 31.6,1.8 31.6,0 25.4,0 25.4,1.8 20.6,1.8 20.6,0 14.4,0 14.4,1.8 9.6,1.8 9.6,0 7,0 arc-90 0,7 0,10.6 7,10.6 7,24.4 0,24.4 0,28 arc-90 7,35 31,35 31,33.1 31.6,32.5 34.2,32.5 34.8,33.1 34.8,35 39,35 arc-90 46,28 46,7 arc-90 39,0
Copper layers (1+2*15+16): Top 0.035mm / dielectric 1.6mm / Route2 0.035mm / dielectric 0.15mm / Route15 0.035mm / dielectric 0.2mm / Bottom 0.035mm
Design rules "jlcpcb-2layers.dru *": minimum track width 5mil, minimum drill 0.2mm, track to track 5mil, track to pad 5mil, pad to pad 5mil, via to via 5mil, smd to smd 5mil, copper to edge 0.2mm, drill to drill 6mil, minimum pad ring 10mil, minimum via ring 3mil, stop-mask expansion 4mil, vias tented up to drill 999mm, thermal gap 10mil

### Footprints (pad centres in the part's own frame; a part is rotated, then mirrored left to right if it is on the bottom)
2450AT18B100E_ANTC3216X140N = smd 1.15 x 1.8: 1 -1.5,0; 2 1.5,0
NORDIC_NRF_3_RESC0201_N = smd 0.4 x 0.45: 1 -0.305,0; 2 0.305,0
NORDIC_NRF_3_RESC0402_N = smd 0.6 x 0.6: 1 -0.55,0; 2 0.55,0
GRM011R60J152KE01L_2_CAPC0201X13N = smd 0.22 x 0.23: 1 -0.185,0; 2 0.185,0
ESP32_C6_LIBRARY_5_SOD3716X135N = smd 1.15 x 0.8: 1 -1.75,0; 2 1.75,0
ESP32_C6_LIBRARY_3_SOT95P280X145-6N = smd 1.2 x 0.6: 1 -1.25,0.95; 2 -1.25,0; 3 -1.25,-0.95; 4 1.25,-0.95; 5 1.25,0; 6 1.25,0.95
BQ25180YBGR_BGA8C40P2X4_100X155X50 = smd 0.2 x 0.2: A1 -0.2,0.6; A2 0.2,0.6; B1 -0.2,0.2; B2 0.2,0.2; C1 -0.2,-0.2; C2 0.2,-0.2; D1 -0.2,-0.6; D2 0.2,-0.6
DRV2605YZFR_BGA9C50P3X3_144X144X62 = smd 0.25 x 0.25: A1 -0.5,0.5; A2 0,0.5; A3 0.5,0.5; B1 -0.5,0; B2 0,0; B3 0.5,0; C1 -0.5,-0.5; C2 0,-0.5; C3 0.5,-0.5
BMA423_BMA423 = smd 0.3 x 0.35: 1 -0.75,-0.775; 2 -0.25,-0.775; 3 0.25,-0.775; 4 0.75,-0.775; 7 0.75,0.775; 8 0.25,0.775; 9 -0.25,0.775; 10 -0.75,0.775 | smd 0.35 x 0.3: 5 0.775,-0.25; 6 0.775,0.25; 11 -0.775,0.25; 12 -0.775,-0.25
RT6160AWSC_BGA15C40P3X5_140X230X60 = smd 0.216 x 0.216: A1 -0.4,0.8; A2 0,0.8; A3 0.4,0.8; B1 -0.4,0.4; B2 0,0.4; B3 0.4,0.4; C1 -0.4,0; C2 0,0; C3 0.4,0; D1 -0.4,-0.4; D2 0,-0.4; D3 0.4,-0.4; E1 -0.4,-0.8; E2 0,-0.8; E3 0.4,-0.8
503480-2400_5034802400 = smd 0.3 x 0.7: 1 -5.75,1.525; 2 -5.25,1.525; 3 -4.75,1.525; 4 -4.25,1.525; 5 -3.75,1.525; 6 -3.25,1.525; 7 -2.75,1.525; 8 -2.25,1.525; 9 -1.75,1.525; 10 -1.25,1.525; 11 -0.75,1.525; 12 -0.25,1.525; 13 0.25,1.525; 14 0.75,1.525; 15 1.25,1.525; 16 1.75,1.525; 17 2.25,1.525; 18 2.75,1.525; 19 3.25,1.525; 20 3.75,1.525; 21 4.25,1.525; 22 4.75,1.525; 23 5.25,1.525; 24 5.75,1.525 | smd 0.3 x 1: MP1 -6.54,-1.125; MP2 6.54,-1.125
TC2030-IDC_TC2030IDC = smd 0.783 x 0.783: 1 -0.953,-0.635; 2 -0.953,0.635; 3 0.317,-0.635; 4 0.317,0.635; 5 1.588,-0.635; 6 1.588,0.635 | hole 2.451: -2.223,-2.54; -2.223,2.54; 0.952,-2.54; 0.952,2.54 | hole 1.067: -2.223,0; 2.857,-1.016; 2.857,1.016
KH-TYPE-C-16P_KINGHELM_KH-TYPE-C-16P = smd 0.6 x 1.15: A1_B12 -3.2,4.725; A4_B9 -2.4,4.725; A9_B4 2.4,4.725; A12_B1 3.2,4.725 | smd 0.3 x 1.15: A5 -1.25,4.725; A6 -0.25,4.725; A7 0.25,4.725; A8 1.25,4.725; B5 1.75,4.725; B6 0.75,4.725; B7 -0.75,4.725; B8 -1.75,4.725 | drill 0.65 pad 1.05: SH1 -4.32,0; SH2 4.32,0; SH3 -4.32,4.15; SH4 4.32,4.15 | hole 0.7: -2.89,3.65; 2.89,3.65
NORDIC_NRF_2_RESC0201_N = smd 0.4 x 0.45: 1 -0.305,0; 2 0.305,0
NORDIC_NRF_2_RESC0402_N = smd 0.6 x 0.6: 1 -0.55,0; 2 0.55,0
MLP2016SR47MT0S1_INDC2016X100N = smd 1.2 x 2.2: 1 -1.028,0; 2 1.028,0
ESP32_C6_LIBRARY_2_IND_4828-WE-TPC_WRE = smd 0.9 x 5.3: 1 -2.286,0; 2 2.286,0
ESP32_C6_LIBRARY_4_ESP32_C6_LIBRARY_4_ESP32_C6_LIBRARY_4_ESP32_C6_LIBRARY_4_ESP32_WROVER_SPARKFUN-DISCRETESEMI_SOT23-3 = smd 0.8 x 0.9: 1 -0.95,-1; 2 0.95,-1; 3 0,1.1
ESP32_C6_LIBRARY_6_SOT65P210X110-3N = smd 1.05 x 0.5: 1 -1.05,0.65; 2 -1.05,-0.65; 3 1.05,0
CPF0201D7K68C1_0201 = smd 0.35 x 0.25: 1 0,0.275; 2 0,-0.275
ESP32_C6_LIBRARY_7_JUMPER_SJ = smd 1.168 x 1.6: 1 -0.762,0; 2 0.762,0
2025-10-22_07-23-44_LIBRARY_SW_EVP-AKE31A_PAN = smd 0.711 x 1.092: 1 -1.4,-0.972; 2 1.4,-0.972 | drill 0.559 pad 0.914 square: 3 -1.848,0.381; 4 1.848,0.381 | smd 1.397 x 1.092: 5 0,-1.124
HECTOR_WATCH_1_TP20R = smd 2 x 2: TP 0,0
NORDIC_NRF_4_AQFN50P700X700X85_HS-74N = smd 4.85 x 4.85: P$74 0,0 | drill 0.3 pad 0.6: P$75 -1.8,1.8; P$76 -0.6,1.8; P$77 0.6,1.8; P$78 1.8,1.8; P$79 -1.8,0.6; P$80 -0.6,0.6; P$81 0.6,0.6; P$82 1.8,0.6; P$83 -1.8,-0.6; P$84 -0.6,-0.6; P$85 0.6,-0.6; P$86 1.8,-0.6; P$87 -1.8,-1.8; P$88 -0.6,-1.8; P$89 0.6,-1.8; P$90 1.8,-1.8 | smd 0.2 x 0.2: P$A8 -1.25,3.25; P$A10 -0.75,3.25; P$A12 -0.25,3.25; P$A14 0.25,3.25; P$A16 0.75,3.25; P$A18 1.25,3.25; P$A20 1.75,3.25; P$A22 2.25,3.25; P$A23 2.75,3.25; P$AA24 3.25,-2.25; P$AB2 -2.75,-2.5; P$AC5 -2,-2.75; P$AC9 -1,-2.75; P$AC11 -0.5,-2.75; P$AC13 0,-2.75; P$AC15 0.5,-2.75; P$AC17 1,-2.75; P$AC19 1.5,-2.75; P$AC21 2,-2.75; P$AC24 3.25,-2.75; P$AD2 -2.75,-3.25; P$AD4 -2.25,-3.25; P$AD6 -1.75,-3.25; P$AD8 -1.25,-3.25; P$AD10 -0.75,-3.25; P$AD12 -0.25,-3.25; P$AD14 0.25,-3.25; P$AD16 0.75,-3.25; P$AD18 1.25,-3.25; P$AD20 1.75,-3.25; P$AD22 2.25,-3.25; P$AD23 2.75,-3.25; P$B1 -3.25,2.75; P$B3 -2.5,2.75; P$B5 -2,2.75; P$B7 -1.5,2.75; P$B9 -1,2.75; P$B11 -0.5,2.75; P$B13 0,2.75; P$B15 0.5,2.75; P$B17 1,2.75; P$B19 1.5,2.75; P$B24 3.25,2.75; P$C1 -3.25,2.25; P$D2 -2.75,2; P$D23 2.75,2; P$E24 3.25,1.75; P$F2 -2.75,1.5; P$F23 2.75,1.5; P$G1 -3.25,1.25; P$H2 -2.75,1; P$H23 2.75,1; P$J1 -3.25,0.75; P$J24 3.25,0.75; P$K2 -2.75,0.5; P$L1 -3.25,0.25; P$L24 3.25,0.25; P$M2 -2.75,0; P$N1 -3.25,-0.25; P$N24 3.25,-0.25; P$P2 -2.75,-0.5; P$P23 2.75,-0.5; P$R1 -3.25,-0.75; P$R24 3.25,-0.75; P$T2 -2.75,-1; P$T23 2.75,-1; P$U1 -3.25,-1.25; P$U24 3.25,-1.25; P$V23 2.75,-1.5; P$W1 -3.25,-1.75; P$W24 3.25,-1.75; P$Y2 -2.75,-2; P$Y23 2.75,-2
ESP32_C6_LIBRARY_SON50P200X200X80-9N = smd 0.76 x 0.27: 1 -0.985,0.75; 2 -0.985,0.25; 3 -0.985,-0.25; 4 -0.985,-0.75; 5 0.985,-0.75; 6 0.985,-0.25; 7 0.985,0.25; 8 0.985,0.75 | smd 0.9 x 1.3: 9 0,0
NORDIC_NRF_BT-XTAL_2016_N = smd 0.95 x 0.85: 1 -0.725,-0.575; 2 0.725,-0.575; 3 0.725,0.575; 4 -0.725,0.575
NORDIC_NRF_1_XTAL_3215_N = smd 1 x 1.8: 1 -1.25,0; 2 1.25,0

### Placement (x,y rotation side)
ANT1  32.9,32.5 89.6 top
C1  29.3,23.9 180 top
C1-EP-DR  13.9,16 270 top
C2  27.9,23.9 0 top
C2-EP-DR  19.5,12.1 180 top
C3  30.7,23.9 0 top
C4  31.1,26.9 180 top
C5  27.7,13.4 180 top
C6  36.3,11.8 270 top
C7  39.8,19.7 0 top
C8  40.5,21.2 270 top
C9  32.1,23.9 180 top
C10  26.1,21.6 180 top
C11  25.9,20.7 180 top
C12  25.9,19.9 180 top
C13  25.9,19.1 180 top
C14  25.13,14.13 180 top
C15  25.8,17.3 180.7 top
C16  25.9,18.3 180 top
C17  26.7,12.1 90 top
C18  26.5,9.2 0 top
C19  31.4,10.1 0 top
C20  37.4,11.8 270 top
C21  39.4,15.9 0 top
C22  31.1,27.8 180 top
C23  41.14,13.58 90 top
C24  39.94,13.37 270 top
C25  41.4,8.5 270 top
C27  5.2,29.1 90 top
C29  8.7,3.2 0 top
C30  18.3,2.2 0 top
C31  32,5.2 0 top
C32  11.4,32.2 270 top
C33  42.5,8.5 270 top
C34  11.7,28.8 0 top
C37  33.7,6.9 90 top
C38  36.8,8.3 90 top
C39  35.1,6.2 270 top
C42  19.1,23.6 270 top
C43  20,24 270 top
D2  21.4,10.2 270 top
D3  22.7,25 270 top
D4  24.3,10.3 90 top
D5  17.8,10.1 90 top
EPD_C1  13,22.2 0 top
EPD_C2  13,21.2 0 top
EPD_C5  12.52,16 270 top
EPD_C6  12.96,13.9 90 top
EPD_C7  14.1,13.9 90 top
EPD_C8  13.1,12.1 0 top
EPD_C9  15.2,11.5 359.2 top
EPD_C10  13.3,10.5 0 top
EPD_C11  13.1,8.9 270 top
EPD_C12  12,8.5 270 top
IC1  34.5,8.2 270 top
IC2  11.8,30.5 0 top
IC3  31.3,11.7 90 top
IC9  40.9,11 0 top
J1  9.1,17.5 270 top
J2  40.4,26.3 89.6 top
J4  23,33.7 180 top
L1  31,25.5 90 top
L2  26.2,15.4 180 top
L3  26,16.3 0 top
L4  43.6,11.6 270 top
L5  18.6,16.5 180 top
Q1  12.5,26.4 90 top
Q3  19.6,20.8 180 top
R1_EP_DR  23,21.1 180 top
R1_TYPE_SEL  24,21.1 0 top
R1_USB  24.9,27.9 270 top
R2  40.2,9.2 270 top
R2_EP_DR  22.1,19.2 180 top
R2_USB  21.3,27.8 0 top
R3  33,10.4 0 top
R4  39.4,10.4 0 top
R5  21.4,5.8 180 top
R7  6.9,4.9 180 top
R8  31.9,5.8 270 top
R9  31.2,7.8 0 top
R17  39.9,8 270 top
R18  38,7 0 top
R_PWR_EPD  14.6,26.4 180 top
SJ1  23.5,18.7 90 top
SW_DN  12,3.2 180 top
SW_ENT  33.9,3.2 180 top
SW_UP  22.9,3.2 180 top
TP_3.3V  44.3,8.4 0 top
TP_3V3  27.5,7.2 0 top
TP_BAT_GND  44.5,16.8 0 top
TP_GND  44.5,20.6 0 top
TP_ON  15.38,30.2 0 top
TP_OP  14.13,33.42 0 top
TP_RESET  38.2,33.7 0 top
TP_SCL  40.7,5.1 270 top
TP_SDA  37.9,4.8 270 top
TP_SWDCLK  34.8,26.9 0 top
TP_SWDIO  35.1,24.4 0 top
TP_SWO  42.4,19.6 0 top
TP_VBAT  3.2,29.7 0 top
TP_VREG  43,14.9 0 top
U1  32.4,18.5 90 top
U3  7.7,29.8 0 top
X1  29.1,26.1 90 top
X2  28.5,10.9 90 top

### Tracks (layer width: path | path; a pad name or v marks a point on that pad's centre or on a via)
3V3  (via drill 0.35)
  Top 0.254: 12.22,28.62 12.05,28.8 C34.2 11.88,29.2
  Top 0.305: C25.1 C33.1 43.65,9.05 TP_3.3V.TP v44.3,6.5 | C25.1 41.4,8.85 41.02,8.85 R17.1 | R18.1 v38,8.2 | IC9.E2 IC9.E3 41.4,10.1 C25.1 | U1.P$AD23 35.91,21.5 C8.1 v41.39,21.5 v41.4,21.5 | v41.9,25.7 41.39,25.7 J2.1 | v15.4,26.7 15.38,26.68 R_PWR_EPD.2 13.93,27.35 Q1.2 12.22,28.62 | IC2.C2 11.88,29.91 11.88,29.2 | R8.2 31.61,5.79 30.2,7.2 v29.8,7.2 | v29.8,7.2 TP_3V3.TP 26.7,6.4 21.73,6.4 R5.2 | IC3.10 30.43,10.85 30.24,10.72 30.08,10.72 | v29.8,7.2 29.8,8.3 31.09,9.59 C19.1 30.2,10.1 30.1,10.2 30.1,10.7 30.08,10.72 | C14.1 26.58,14.13 v27,14.55 28.95,14.55 U1.P$B1 | U1.P$AD14 36.55,18.75 v37.49,19.7 C7.1 | U1.P$W1 34.75,15.25 v35.3,14.7 35.3,14.5 36.3,13.5 C6.1 | C12.1 26.5,20.2 27.3,20.2 v27.8,20.7 29,20.7 29.05,20.75 U1.P$A22 | IC3.7 30.15,12.45 29.9,12.2 29.9,10.9 30.08,10.72 | R7.2 5.43,5.18 v5.2,5.4 | IC3.3 32.65,11.95 v32.9,12.2
  pour Route15: 7.06,10.56 7.04,10.54 7.02,10.52 0.08,10.52 0.08,7 0.12,6.22 0.25,5.46 0.46,4.71 0.76,4 1.14,3.32 1.59,2.68 2.1,2.1 2.68,1.59 3.32,1.14 4,0.76 4.71,0.46 5.46,0.25 6.22,0.12 7,0.08 9.52,0.08 9.52,1.82 9.54,1.84 9.56,1.86 9.58,1.88 14.42,1.88 14.44,1.86 14.46,1.84 14.48,1.82 14.48,0.08 20.52,0.08 20.52,1.82 20.54,1.84 20.56,1.86 20.58,1.88 25.42,1.88 25.44,1.86 25.46,1.84 25.48,1.82 25.48,0.08 31.52,0.08 31.52,1.82 31.54,1.84 31.56,1.86 31.58,1.88 36.42,1.88 36.44,1.86 36.46,1.84 36.48,1.82 36.48,0.08 39,0.08 39.78,0.12 40.54,0.25 41.29,0.46 42,0.76 42.68,1.14 43.32,1.59 43.9,2.1 44.41,2.68 44.86,3.32 45.24,4 45.54,4.71 45.75,5.46 45.88,6.22 45.92,7 45.92,28 45.88,28.78 45.75,29.54 45.54,30.29 45.24,31 44.86,31.68 44.41,32.32 43.9,32.9 43.32,33.41 42.68,33.86 42,34.24 41.29,34.54 40.54,34.75 39.78,34.88 39,34.92 7,34.92 6.22,34.88 5.46,34.75 4.71,34.54 4,34.24 3.32,33.86 2.68,33.41 2.1,32.9 1.59,32.32 1.14,31.68 0.76,31 0.46,30.29 0.25,29.54 0.12,28.78 0.08,28 0.08,24.48 7.02,24.48 7.04,24.46 7.06,24.44 7.08,24.42 7.08,10.58
ALTER  (via drill 0.2)
  Top 0.152: U3.5 10.23,27.5 v11.3,27.5 | v17.6,26.1 v17.6,25 | v26.4,25.1 25.2,25.1 v25.1,25.2 | v31.6,22.4 31.6,21.8 U1.P$J24
  Bottom 0.152: v11.3,27.5 16.3,27.5 17.6,26.2 v17.6,26.1 | v25.1,25.2 17.8,25.2 v17.6,25 | v26.4,25.1 29.1,22.4 v31.6,22.4
D+  (via drill 0.2)
  Top 0.152: U1.P$AD6 36.35,16.75 v36.4,16.7 | v37.7,15.1 37.3,14.7 v37.3,14.1 | v35.5,13.5 35.2,13.2 v34.4,13.2 | v33.5,9.7 32.4,8.6 v32.3,8.6 | v22.9,12.49 22.9,14.9 21.7,16.1 21.7,20.4 v21.8,20.5 | v20.9,23.6 21.05,23.75 D3.4
  Bottom 0.152: v36.4,16.7 36.4,16.4 v37.7,15.1 | v37.3,14.1 36.7,13.5 v35.5,13.5 | v34.4,13.2 34.4,11.8 33.5,10.9 v33.5,9.7 | v32.3,8.6 24,8.6 22.9,9.7 v22.9,12.49 | v21.8,20.5 21.27,20.5 arc-90 21.16,20.61 arc90 21.06,20.72 20.8,20.72 arc90 20.69,20.61 20.69,20.39 arc-90 20.59,20.28 20.33,20.28 arc-90 20.22,20.39 20.22,20.61 arc90 20.12,20.72 19.86,20.72 arc90 19.75,20.61 19.75,20.39 arc-90 19.65,20.28 19.39,20.28 arc-90 19.28,20.39 19.28,20.61 arc90 19.18,20.72 18.92,20.72 arc90 18.82,20.61 18.82,20.39 arc-90 18.71,20.28 18.45,20.28 arc-90 18.34,20.39 18.34,20.61 arc90 18.24,20.72 17.98,20.72 arc90 17.88,20.61 17.88,20.39 arc-90 17.77,20.28 17.51,20.28 arc-90 17.41,20.39 17.41,20.61 arc90 17.3,20.72 17.04,20.72 arc90 16.93,20.61 arc-90 16.83,20.5 16.2,20.5 15.8,20.9 15.8,21.3 17.4,22.9 20.5,22.9 20.9,23.3 v20.9,23.6
D-  (via drill 0.2)
  Top 0.152: U1.P$AD4 37.75,16.25 v37.8,16.2 | v38.3,14.4 37.8,13.9 v37.8,13.4 | v35.5,12.7 34.7,11.9 v33.9,11.9 | v32.77,13.37 31.77,13.37 v31.7,13.3 | v16.4,21.2 14.7,19.5 v14.7,16.9 | v24.7,23.9 24.55,23.75 D3.6 | v14.9,13.5 v14.9,15.3
  Bottom 0.152: v37.8,16.2 38.3,15.7 v38.3,14.4 | v37.8,13.4 37.1,12.7 v35.5,12.7 | v33.9,11.9 33.9,12 32.77,13.13 v32.77,13.37 | v16.4,21.2 17.7,22.5 23.3,22.5 v24.7,23.9 | v14.9,13.5 15.4,13 18.8,13 19.1,13.3 24.04,13.29 24.04,13.28 31.68,13.28 v31.7,13.3 | v14.9,15.3 14.9,16.7 v14.7,16.9
DEC1
  Top 0.152: C5.1 28.8,13.4 30.15,14.75 U1.P$C1
DEC2
  Top 0.152: U1.P$A18 27.55,19.75 26.9,19.1 C13.1
DEC3  (via drill 0.2)
  Top 0.152: U1.P$D23 29.85,21.25 v29.7,21.1 | v26.9,20.9 26.7,20.7 C11.1
  Bottom 0.152: v29.7,21.1 29.5,21.3 27.3,21.3 v26.9,20.9
DEC4_6  (via drill 0.2)
  Top 0.152: U1.P$B5 29.45,16.3 L3.2 26.25,16.36 26.25,17.21 C15.1 26.15,17.51 26.15,18.25 C16.1 | v24.9,18.3 v24.9,20.6
  Bottom 0.152: U1.P$E24 30.3,22.1 27.15,22.1 C10.1 25.65,20.6 v24.9,20.6 | C16.1 v24.9,18.3
  other vias: 26.65,21.6 30.65,21.75 26.2,18.3
DN
  Top 0.152: D3.1 23.75,26.35 J4.B7 23.75,29.85 23.5,30.1 23,30.1 22.75,29.85 J4.A7
DP
  Top 0.152: D3.3 21.75,27.3 22.45,28 | 22.45,28 23.1,28 23.25,28.15 J4.A6 | 22.45,28 22.25,28.2 J4.B6
EPD_3V3
  Top 0.152: Q1.3 8.4,23.4 8.4,17.8 9.95,16.25 J1.15 | J1.16 J1.15 | J1.15 12.22,16.25 EPD_C5.1 C1-EP-DR.1 14.4,16.05 15.86,16.05 L5.2
EPD_BUSY  (via drill 0.2)
  Top 0.152: U1.P$AD12 42.35,18.25 v43.1,17.5 | v5.6,9.6 v8.4,9.6 | v8.9,19.8 9.45,19.25 J1.9
  Bottom 0.152: v43.1,17.5 43.2,17.4 43.2,5.8 41.4,4 8.8,4 5.6,7.2 v5.6,9.6 | v8.4,9.6 8.4,19.3 v8.9,19.8
EPD_CS  (via drill 0.2)
  Top 0.152: J1.12 12.85,17.75 v13.2,17.4
  Bottom 0.152: v13.2,17.4 13.2,15.9 15.12,13.98 30.88,13.98 31.9,15 U1.P$K2
  other vias: 31.9,15.75
EPD_DC  (via drill 0.2)
  Top 0.152: U1.P$AD10 38.35,17.75 38.7,17.4 41.5,17.4 41.9,17 v41.9,16.6 | v8.8,8 8.7,7.9 v6.8,7.9 | J1.11 10.57,18.2 v9.8,18.2
  Bottom 0.152: v41.9,16.6 41.9,5.8 40.7,4.6 9,4.6 6.8,6.8 v6.8,7.9 | v8.8,8 9.2,8.4 9.2,17.6 v9.8,18.2
EPD_RST  (via drill 0.2)
  Top 0.152: v39.1,17.8 41.7,17.8 42.7,16.8 v42.7,16.6 | v8.6,8.8 v6.2,8.8 | v8.9,18.8 10.57,18.8 J1.10
  Bottom 0.152: U1.P$AC11 38.9,18 v39.1,17.8 | v42.7,16.6 42.7,6.2 40.8,4.3 8.9,4.3 6.2,7 v6.2,8.8 | v8.9,18.8 8.9,9.1 v8.6,8.8
  other vias: 35.15,18
GDR
  Top 0.152: J1.2 18.05,22.75 Q3.1 21.5,21 22.2,21 22.5,20.7 22.5,20.3 22.1,19.9 R2_EP_DR.2
GND  (via drill 0.25, 0.35)
  Top 0.203: C23.2 41.14,14.54 | C37.1 34,6.71 | C42.1 v19.1,24.5 | C34.1 10.4,28.8 | C38.1 36.9,8.02 | C27.1 5.41,28.71 | IC1.D2 33.6,7.7 v33.3,7.7
  Top 0.254: 41.14,14.54 41.28,14.68 | 40.5,11.2 IC9.B1 40.1,11.4 | 34.21,6.51 34,6.71 | C31.1 31.41,4.8 | C30.1 v16.7,2.2 | C32.1 10.6,33.19 | C29.1 8,3.2 | 5.41,28.71 5.61,28.5
  Top 0.305: C8.2 42,20.89 v42.6,21.5 | J2.3 41.05,26.62 J2.5 40.4,28.53 v40.4,30 | TP_GND.TP v44.5,18.6 TP_BAT_GND.TP | v41.28,14.84 41.28,14.68 | 40.61,14.84 v41.28,14.84 | 40.5,11.2 IC9.C1 IC9.C2 IC9.C3 | 40.1,11.4 v39.6,11.4 | C33.2 C25.2 41.4,7.4 v40.9,6.9 | SW_ENT.1 35.3,5.45 C39.2 | C39.2 35.06,5.65 34.21,6.51 | C39.2 35.05,5.7 v33.3,5.7 | 31.41,4.8 31.41,4.31 v29.1,2 28.1,2 26.3,3.8 24.67,3.8 SW_UP.1 | IC3.8 IC3.9 30.57,11.5 31.1,11.5 v31.3,11.7 | v16.7,2.2 15.1,3.8 13.77,3.8 SW_DN.1 | EPD_C9.2 15.7,11.54 v15.7,12.4 13.95,12.4 EPD_C8.2 | EPD_C11.2 v13.1,7 12.95,7 EPD_C12.2 10.98,7.95 J1.MP2 | EPD_C10.2 14.25,10.1 v14.9,10.1 | EPD_C7.2 13.9,14.65 C1-EP-DR.2 EPD_C5.2 12.52,14.89 EPD_C6.2 12.4,14.45 v11.6,15.25 J1.17 | EPD_C1.2 EPD_C2.2 13.6,21.15 v13.6,19.9 13.45,19.75 J1.8 | SJ1.1 22.6,17.94 22.1,18.44 R2_EP_DR.1 | SJ1.1 24.2,17.24 25.2,17.24 C15.2 25.59,17.64 C16.2 C13.2 C12.2 C11.2 25.55,20.75 C10.2 24.23,21.6 R1_TYPE_SEL.1 | SJ1.1 23.5,16.4 v24.2,15.7 24.2,14.51 C14.2 | C43.1 19.15,24.55 v19.1,24.5 | R1_USB.1 26.1,27.9 26.2,28 J4.A1_B12 26.77,29.55 J4.SH3 | J4.SH4 19.25,28.98 J4.A12_B1 19.84,28.98 19.84,27.86 20.18,27.52 R2_USB.2 | v22.7,27.4 D3.2 | C4.2 29.9,26.9 29.75,26.75 | 29.75,26.75 X1.2 29.68,27.98 v29.7,28 29.9,27.8 C22.2 | 29.75,26.75 28.52,25.52 X1.4 28.52,24.77 29,24.3 C1.2 C2.2 | IC2.B1 11,30.5 8.8,32.7 v8.8,33.2 8.81,33.19 10.6,33.19 | IC2.B3 v13.5,30.5 | 10.4,28.8 v10.3,28.9 9.65,29.55 U3.6 7.95,29.55 U3.9 | 5.9,28.52 v5.9,28.5 5.61,28.5 | U3.4 5.9,28.52 | U3.1 5.45,30.55 v5.4,30.6 | v24.3,7 D4.1 24.2,8.65 24.75,9.2 C18.1 26.2,11.29 26.5,11.59 | C3.2 C9.2 v31.8,25.09 v31.8,25.1
  Top 0.305: J1.MP1 7.97,26.44 5.9,28.52 | 36.9,8.02 v36.9,7.3 | 40.66,14.84 39.95,15.55 C21.2 | v41.28,14.84 40.66,14.84 | 26.5,11.59 C17.1 | C5.2 27,13 26.2,13 25.9,12.7 25.9,11.9 26.21,11.59 26.5,11.59 | R9.1 31.2,8.8 v31.5,9.1 31.7,9.3 C19.2 31.73,10.12 R3.2 33.1,10.22 34.48,10.22 35.5,11.25 C6.2 C20.2 | 8,3.2 v6.8,2 | C7.2 40.4,19.41 v40.4,18.9 | U1.P$B7 29.55,17 29.35,16.8 v28.8,16.8 | U1.P$F23 30.9,20.6 U1.P$78 | U1.P$74 U1.P$85 | 40.66,14.84 39.94,14.12 C24.1
  other vias: 33.4,29.1 32.8,28.5 32.2,27.9 32,29.1 31.4,28.5
  pour Route2: 7.06,10.56 7.04,10.54 7.02,10.52 0.08,10.52 0.08,7 0.12,6.22 0.25,5.46 0.46,4.71 0.76,4 1.14,3.32 1.59,2.68 2.1,2.1 2.68,1.59 3.32,1.14 4,0.76 4.71,0.46 5.46,0.25 6.22,0.12 7,0.08 9.52,0.08 9.52,1.82 9.54,1.84 9.56,1.86 9.58,1.88 14.42,1.88 14.44,1.86 14.46,1.84 14.48,1.82 14.48,0.08 20.52,0.08 20.52,1.82 20.54,1.84 20.56,1.86 20.58,1.88 25.42,1.88 25.44,1.86 25.46,1.84 25.48,1.82 25.48,0.08 31.52,0.08 31.52,1.82 31.54,1.84 31.56,1.86 31.58,1.88 36.42,1.88 36.44,1.86 36.46,1.84 36.48,1.82 36.48,0.08 39,0.08 39.78,0.12 40.54,0.25 41.29,0.46 42,0.76 42.68,1.14 43.32,1.59 43.9,2.1 44.41,2.68 44.86,3.32 45.24,4 45.54,4.71 45.75,5.46 45.88,6.22 45.92,7 45.92,28 45.88,28.78 45.75,29.54 45.54,30.29 45.24,31 44.86,31.68 44.41,32.32 43.9,32.9 43.32,33.41 42.68,33.86 42,34.24 41.29,34.54 40.54,34.75 39.78,34.88 39,34.92 7,34.92 6.22,34.88 5.46,34.75 4.71,34.54 4,34.24 3.32,33.86 2.68,33.41 2.1,32.9 1.59,32.32 1.14,31.68 0.76,31 0.46,30.29 0.25,29.54 0.12,28.78 0.08,28 0.08,24.48 7.02,24.48 7.04,24.46 7.06,24.44 7.08,24.42 7.08,10.58
HAPTIC_EN  (via drill 0.2)
  Top 0.152: U1.P$U1 33.65,15.05 33.8,14.9 34,14.9 34.8,14.1 v34.8,14 | v10.4,32.1 11.3,31.2 IC2.A1
  Bottom 0.152: v34.8,14 34.9,13.9 34.9,12.5 35.9,11.5 35.9,10.1 34.8,9 33.5,9 32.6,8.1 31.6,8.1 29.6,6.1 8.9,6.1 8,7 8,25 7.5,25.5 4.4,25.5 4,25.9 4,30.7 5.4,32.1 v10.4,32.1
IMU_INT1  (via drill 0.2)
  Top 0.152: IC3.5 31.55,12.68 31.75,12.88 32.88,12.88 33.4,13.4 v33.4,13.6 | v33.8,14.5 33.5,14.5 33.1,14.9 33,14.9 U1.P$N1
  Bottom 0.152: v33.8,14.5 33.8,14 v33.4,13.6
IMU_INT2  (via drill 0.2)
  Top 0.152: IC3.6 31.05,13.55 31.53,14.03 v32.77,14.03
  Bottom 0.152: v32.77,14.03 32.9,14.16 U1.P$P2
  other vias: 32.9,15.75
LX1
  Top 0.152: IC9.B2 IC9.B3 42.37,11.4 L4.1
LX2
  Top 0.152: IC9.D2 IC9.D3 43.57,10.6 L4.2
MOSI  (via drill 0.2)
  Top 0.152: v12.11,17.29 11.57,16.75 J1.14 | v27.3,17.9 28.1,17.9 28.4,17.6 v28.6,17.6
  Bottom 0.152: v27.3,17.9 12.72,17.9 v12.11,17.29 | v28.6,17.6 29.4,17.6 29.7,17.9 29.7,18.45 U1.P$B13
  other vias: 29.65,18.5
N$1
  Top 0.152: L3.1 25.65,16.25 L2.2
N$2
  Top 0.152: C20.1 37.4,13.3 35.27,15.43 35.27,16.38 U1.P$AC5
N$4
  Top 0.152: U1.P$B3 29.05,15.4 L2.1
N$5
  Top 0.152: U1.P$H23 31.2,21.45 31.2,22.1 30.39,22.91 C3.1 30.39,24.59 L1.1
N$6
  Top 0.152: U1.P$N24 32.41,22 C9.1
N$7
  Top 0.152: U1.P$A23 29.15,21.95 27.59,23.5 C2.1 27.59,25.89 X1.3
N$8
  Top 0.152: L1.2 31,26.1 31.41,26.51 C4.1 C22.1 32.91,29.3 32.91,30.98 ANT1.1
N$9
  Top 0.152: U1.P$B24 29.61,21.8 C1.1 29.61,25.3 X1.1
N$10
  Top 0.152: IC9.D1 R4.1
N$11
  Top 0.152: R2.1 40.48,10.18 IC9.E1
N$12
  Top 0.152: C39.1 34.7,7.15 IC1.B2
N$13
  Top 0.152: IC1.D1 33.8,8.3 33.17,8.3 32.4,7.53 R9.2
N$14
  Top 0.152: R3.1 32.1,10.68 32.08,10.7 IC3.1
N$16
  Top 0.152: Q3.3 18.55,20.34 20.89,18 L5.1 20.89,14.19 20.1,13.4 19.7,13.4 19.2,12.89 C2-EP-DR.2 18.05,12.1 D5.2
N$17
  Top 0.152: C2-EP-DR.1 19.95,11.95 D2.1 21.5,12.05 D4.2
N$18
  Top 0.152: R2_USB.1 21.25,28.12 J4.B5
N$20
  Top 0.152: R1_TYPE_SEL.2 R1_EP_DR.1 23,19.96 SJ1.2
N$21
  Top 0.152: R1_USB.2 24.25,28.27 J4.A5
N$23
  Top 0.152: C32.2 11.8,31.62 IC2.A2
N$25
  Top 0.152: EPD_C1.1 12,21.75 J1.4
N$26
  Top 0.152: EPD_C2.1 10.68,21.2 J1.5
N$28
  Top 0.152: EPD_C6.1 12.75,13.35 11.35,14.75 J1.18
N$29
  Top 0.152: J1.19 11.15,14.25 12.6,12.8 13.7,12.8 14.1,13.2 EPD_C7.1
N$30
  Top 0.152: J1.20 11.15,13.75 12.55,12.35 EPD_C8.1
N$32
  Top 0.152: J1.22 11.15,12.75 11.6,12.3 11.6,11.3 12.4,10.5 EPD_C10.1
N$34
  Top 0.152: J1.24 10.62,10.43 EPD_C12.1
OUT+
  Top 0.152: IC2.A3 12.3,31.59 TP_OP.TP
OUT-
  Top 0.152: IC2.C3 15.18,30 TP_ON.TP
P0.00/XL1
  Top 0.152: U1.P$D2 30.7,15.45 30.7,14.35 X2.2 28.25,12.41 C17.2
P0.00/XL2
  Top 0.152: C18.2 27.25,9.65 X2.1
P0.13  (via drill 0.2)
  Top 0.152: C30.2 20.46,4.17 SW_UP.2 21.5,5.43 R5.1 22.98,5.53 v23,5.5 | U1.P$AD8 36.85,17.25 v37.1,17
  Bottom 0.152: v23,5.5 29.5,5.5 31.2,7.2 33.3,7.2 33.8,6.7 37.6,6.7 38.5,7.6 38.5,9.4 39.1,10 39.1,16 38.1,17 v37.1,17
P0.14  (via drill 0.2)
  Top 0.152: SW_ENT.2 32.5,4.88 C31.2 32.17,5.21 R8.1 32.77,6.4 v32.8,6.4
  Bottom 0.152: v32.8,6.4 38.6,6.4 40.5,8.3 40.5,11.9 39.4,13 39.4,16.1 38,17.5 U1.P$AC9
  other vias: 35.15,17.5
P1.01  (via drill 0.2)
  Top 0.152: Q1.1 14.18,26.12 R_PWR_EPD.1 15.07,26.12 v15.4,25.8 | v26.5,25.9 26.1,26.3 v25.2,26.3
  Bottom 0.152: v15.4,25.8 15.7,25.5 24.4,25.5 v25.2,26.3 | v26.5,25.9 29.5,22.9 32,22.9 32.9,22 32.9,21.6 33.25,21.25 U1.P$Y23
  other vias: 34.4,21.25
P1.02  (via drill 0.2)
  Top 0.152: C29.2 9.86,4.17 SW_DN.2 10.17,4.6 R7.1 6.5,4.6 v6,4.1 | U1.P$W24 34.15,22.45 v34.1,22.5 | v38.9,22 40,22 40.4,22.4 v45.4,22.4
  Bottom 0.152: v34.1,22.5 38.4,22.5 v38.9,22 | v45.4,22.4 45.4,6.6 42.5,3.7 6.4,3.7 v6,4.1
PMIC_INT  (via drill 0.2)
  Bottom 0.152: IC1.A1 35.1,8.8 38.2,11.9 38.2,13.9 36.35,15.75 U1.P$T2
  other vias: 35.1,8.4 33.4,15.75
PREVGH
  Top 0.152: J1.21 11.05,13.25 11.9,12.4 11.9,11.5 12.2,11.2 14.34,11.2 EPD_C9.1 14.65,11.25 17.55,8.35 D5.1
PREVGL
  Top 0.152: J1.23 11.15,12.25 11.3,12.1 11.3,10.9 12.75,9.45 EPD_C11.1 15.35,7.2 20.15,7.2 D2.2
RESET  (via drill 0.2)
  Top 0.152: J2.6 39.41,27.89 38.2,29.1 | 38.2,29.1 TP_RESET.TP | Q3.2 20.73,21.38 R1_EP_DR.2 23.4,21.38 24.26,22.24 25.76,22.24 27,23.48 27,26.3 27.3,26.6 v27.5,26.6 | v32.5,25.8 32.5,26.7 34.9,29.1 38.2,29.1
  Bottom 0.152: J2.6 39.78,24.78 39.5,24.5 39.5,19.5 38.5,18.5 U1.P$AC13 | v32.5,25.8 28.3,25.8 v27.5,26.6
  other vias: 39.78,27.89 35.15,18.5
SCK  (via drill 0.2)
  Top 0.152: U1.P$A12 28.6,18.8 v27.4,18.8 | v9.7,17.3 10.57,17.3 J1.13
  Bottom 0.152: v27.4,18.8 11.2,18.8 v9.7,17.3
SCL  (via drill 0.2)
  Top 0.152: TP_SCL.TP 39.62,6.18 R17.2 38.9,8.72 38.9,9.62 R4.2 38.88,10.12 v38.7,10.3 | v37.6,10.3 36.4,9.1 35.4,9.1 | 35.4,9.1 35.2,9.1 34.7,8.6 IC1.B1 | v35.4,10.2 35.4,9.1 | U3.7 8.73,30 IC2.C1 v11.3,29.4 | v11.45,18.34 v11.45,19.25
  Bottom 0.152: v38.7,10.3 v37.6,10.3 | IC3.12 32.34,11.71 32.34,15.69 U1.P$M2 | IC3.12 31.55,10.55 32.8,9.3 34.7,9.3 35.4,10 v35.4,10.2 | v11.3,29.4 11.3,28.6 10.1,27.4 10.1,24.6 11.45,23.25 v11.45,19.25 | IC3.12 25.45,10.93 23.42,12.95 19.22,12.95 18.1,11.83 13.41,11.83 12.15,13.09 12.15,16.45 11.45,17.15 v11.45,18.34
  other vias: 31.55,10.93 32.4,15.75
SDA  (via drill 0.2)
  Top 0.152: R2.2 40,9.12 v40,8.7 | v38.9,8.1 38.9,7.1 38.5,6.7 38.02,6.7 R18.2 | R18.2 38,4.9 TP_SDA.TP | v34.5,9.7 34.5,8.9 34.3,8.7 IC1.C1 | v34.2,10.8 33.7,10.8 33.05,11.45 32.85,11.45 | 32.85,11.45 IC3.2 | R18.2 37.58,6.3 36.4,6.3 36,6.7 v36,7.3 | 32.85,11.45 33.8,12.4 33.8,13.8 33.2,14.4 33,14.4 U1.P$L1 31.7,14.8 v31.1,14.8 | v10,30.5 8.73,30.5 U3.8 | v16,23.3 16,26.9 v13.3,29.6 | v15.3,17.3 15.3,19.4 16.9,21 16.9,21.3 v16,22.2
  Bottom 0.152: v40,8.7 39.2,8.7 38.9,8.4 v38.9,8.1 | v34.2,10.8 34.5,10.5 v34.5,9.7 | v36,7.3 34.7,7.3 34.3,7.7 IC1.C1 | v10,30.5 IC2.B2 12.7,29.6 v13.3,29.6 | v31.1,14.8 29.5,14.8 27,17.3 v15.3,17.3 | v16,22.2 v16,23.3
  other vias: 34.3,8.4 11.8,30.5
SWDCLK
  Top 0.152: J2.4 38.75,25.6 37.2,25.6 35.9,26.9 TP_SWDCLK.TP 34.8,25.9 33.8,24.9 33.8,23.7 34.65,22.85 U1.P$AA24
SWDIO
  Top 0.152: J2.2 39.5,25.09 39.5,23.3 38.7,22.5 37,22.5 TP_SWDIO.TP 35.1,21.8 U1.P$AC24
SWO
  Top 0.152: TP_SWO.TP 41.3,19.6 40.5,20.4 36,20.4 U1.P$AD22
VBAT  (via drill 0.35)
  Top 0.152: IC1.C2 34.3,7.59
  Top 0.254: 6.65,29.48 5.4,29.48 C27.2 5,29.48 3.41,29.48 | 33.4,7.09 C37.2 33.8,7.09 34.3,7.59
  Top 0.305: U3.2 U3.3 6.65,29.48 | 3.41,29.48 3.35,29.55 | 3.35,29.55 TP_VBAT.TP | 33.4,7.09 32.09,7.09 v31.7,6.7 | v3.1,27.8 3.1,29.3 3.35,29.55
  Bottom 0.305: v3.1,27.8 3.1,25.8 4,24.9 7.2,24.9 7.5,24.6 7.5,6.9 9.4,5 30,5 v31.7,6.7
VBUS  (via drill 0.35)
  Top 0.152: IC1.A2 35.2,7.9
  Top 0.254: 37.01,8.69 C38.2 36.78,8.5 36.3,8.5 35.7,7.9 35.2,7.9 | 19.96,23.41 C42.2
  Top 0.305: C21.1 38.85,11.4 38.1,10.65 38.1,9.79 37.01,8.69 | C21.1 38.65,15.7 35.7,15.7 U1.P$AD2 | 19.96,23.41 C43.2 20,22.6 20.6,22 v22.4,22 22.7,22.3 D3.5 | v39.4,16.9 39.4,16.45 C21.1 | J4.A4_B9 25.2,29.18 25.2,29.9 24.4,30.7 23,30.7 | 23,30.7 21.7,30.7 20.8,29.8 20.8,29.5 20.6,29.3 J4.A9_B4 | 23,30.7 23.9,31.6 28.8,31.6 v29.5,30.9
  Bottom 0.305: v39.4,16.9 44.8,22.3 44.8,29.3 43.4,30.7 38.7,30.7 35.2,27.2 26.8,27.2 | v22.4,22 23.4,22 24.1,22.7 24.8,22.7 25.7,23.6 25.7,26.1 26.8,27.2 | 26.8,27.2 28.8,29.2 28.8,30 29.5,30.7 v29.5,30.9
VREG
  Top 0.254: 40.91,13.16 C23.1 41.5,13.39 41.6,13.5 | IC9.A2 IC9.A1 40.5,12.26
  Top 0.305: 41.6,13.5 TP_VREG.TP | IC9.A2 IC9.A3 | 40.5,12.26 C24.2 40.29,13.17 40.89,13.17 40.91,13.16
(copper drawn outside any net)
  shapes: Route15 area x1, Route2 area x1